# EAGLE schematic foxBMS_BMS-Slave_12cell (EAGLE 6.5.0), part 1 of 3
AUTHOR: Fraunhofer IISB foxBMS Team; REL-DATE: 2017-09-04; TITLE: foxBMS BMS-Slave 12-Cell; VERSION: 2.1.0
Assembly variants: foxBMS_Standard, foxBMS_Debug, foxBMS_DC-DC-only

## Sheet 1 of 17: Overview
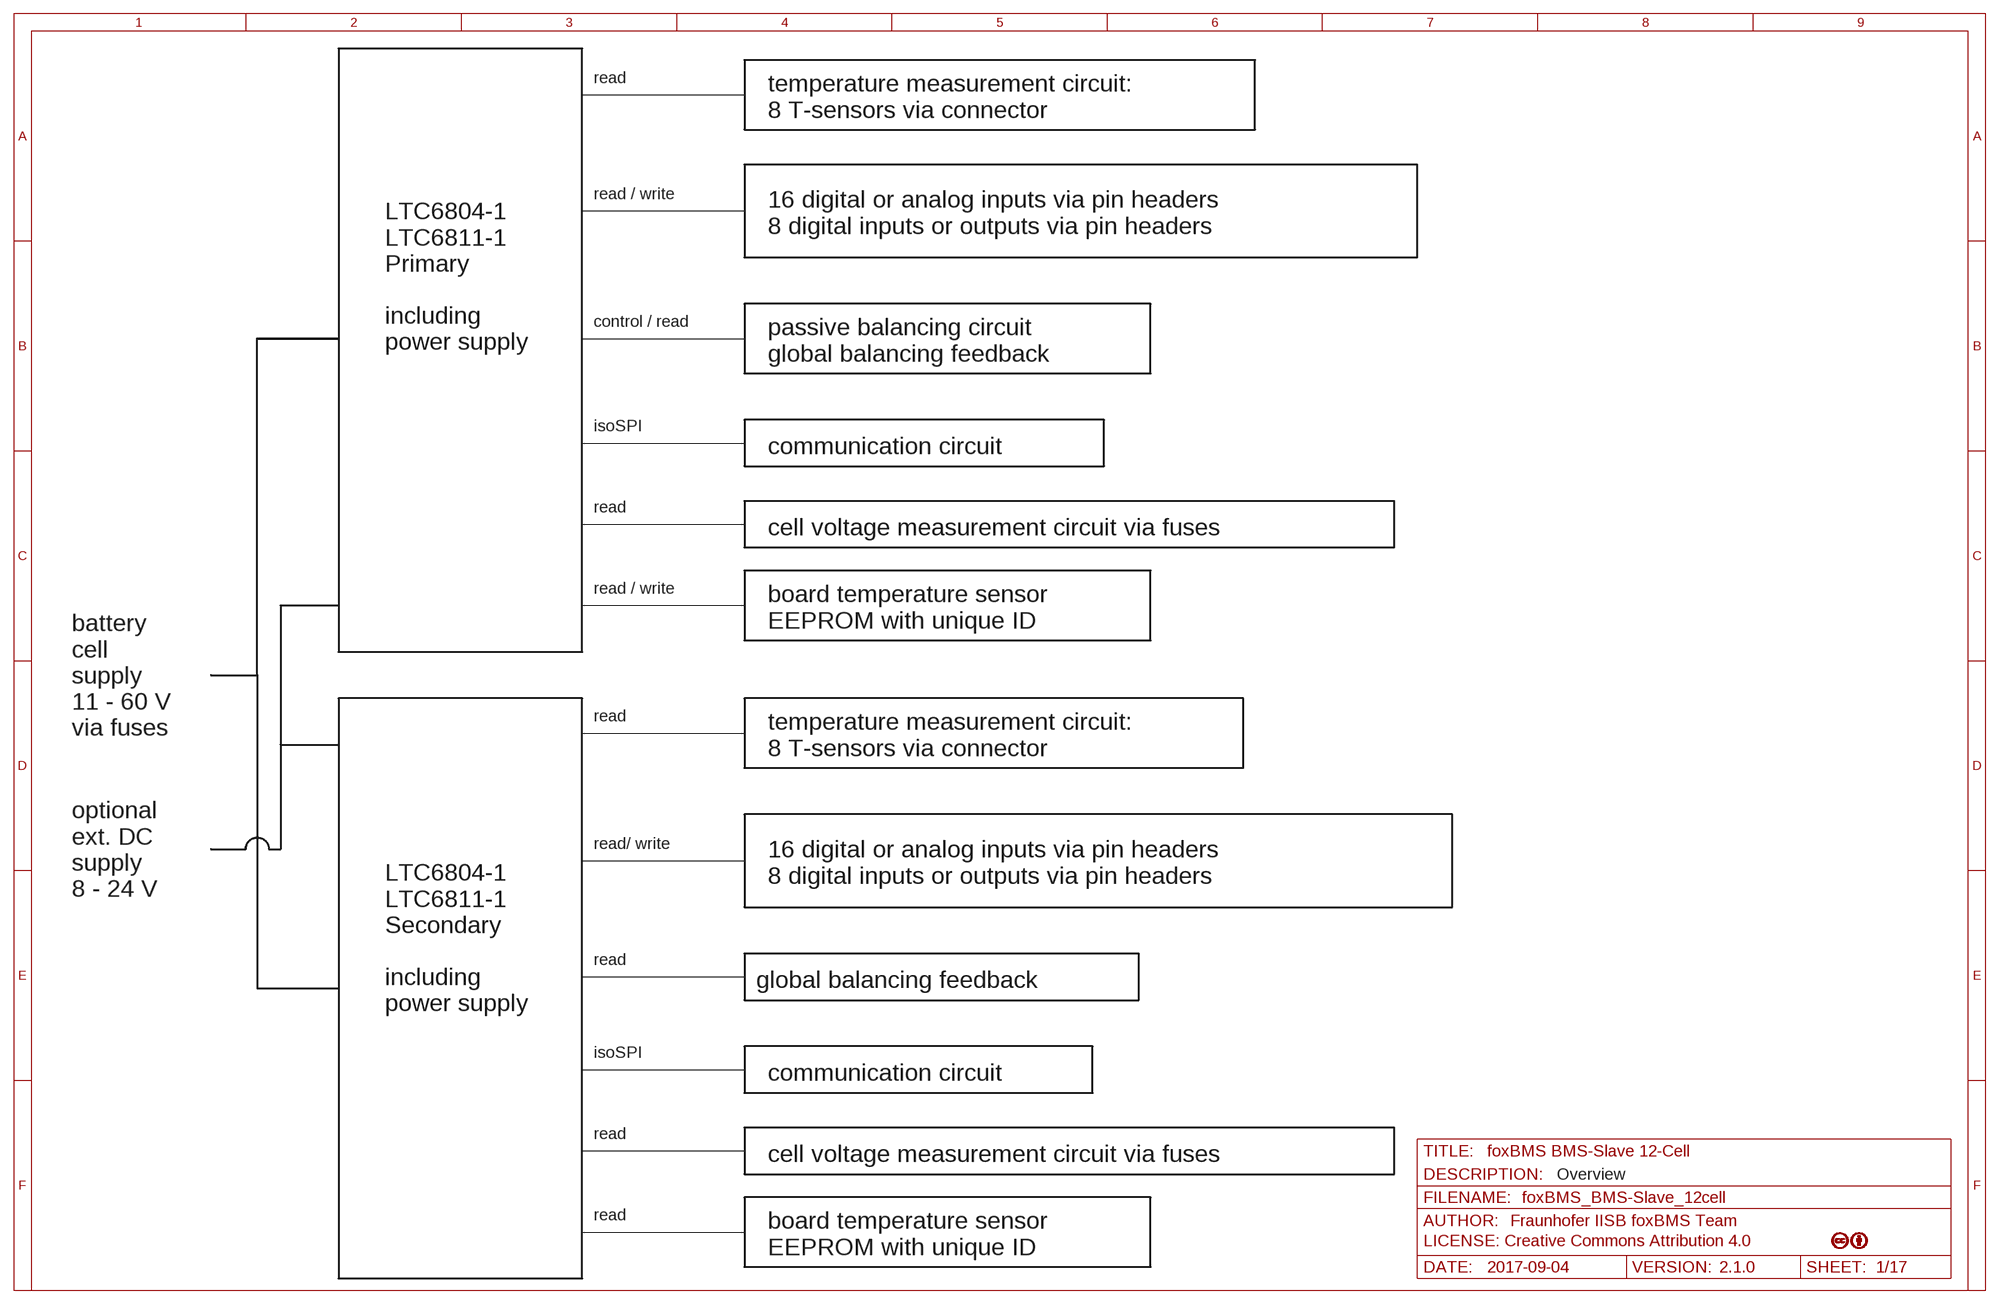
[diagram p0: schematic, sheet 1]

### Notes on the sheet
- read
- temperature measurement circuit:
  8 T-sensors via connector
- read / write
- 16 digital or analog inputs via pin headers
  8 digital inputs or outputs via pin headers
- control / read
- LTC6804-1
  LTC6811-1
  Primary
  
  including 
  power supply
- passive balancing circuit
  global balancing feedback
- isoSPI
- communication circuit
- read
- cell voltage measurement circuit via fuses
- read / write
- board temperature sensor
  EEPROM with unique ID
- battery 
  cell
  supply
  11 - 60 V
  via fuses
- read
- temperature measurement circuit:
  8 T-sensors via connector
- optional
  ext. DC
  supply
  8 - 24 V
- read/ write
- 16 digital or analog inputs via pin headers
  8 digital inputs or outputs via pin headers
- read
- global balancing feedback
- LTC6804-1
  LTC6811-1
  Secondary
  
  including 
  power supply
- isoSPI
- communication circuit
- read
- cell voltage measurement circuit via fuses
- Overview
- read
- board temperature sensor
  EEPROM with unique ID

## Sheet 2 of 17: Primary LTC6804
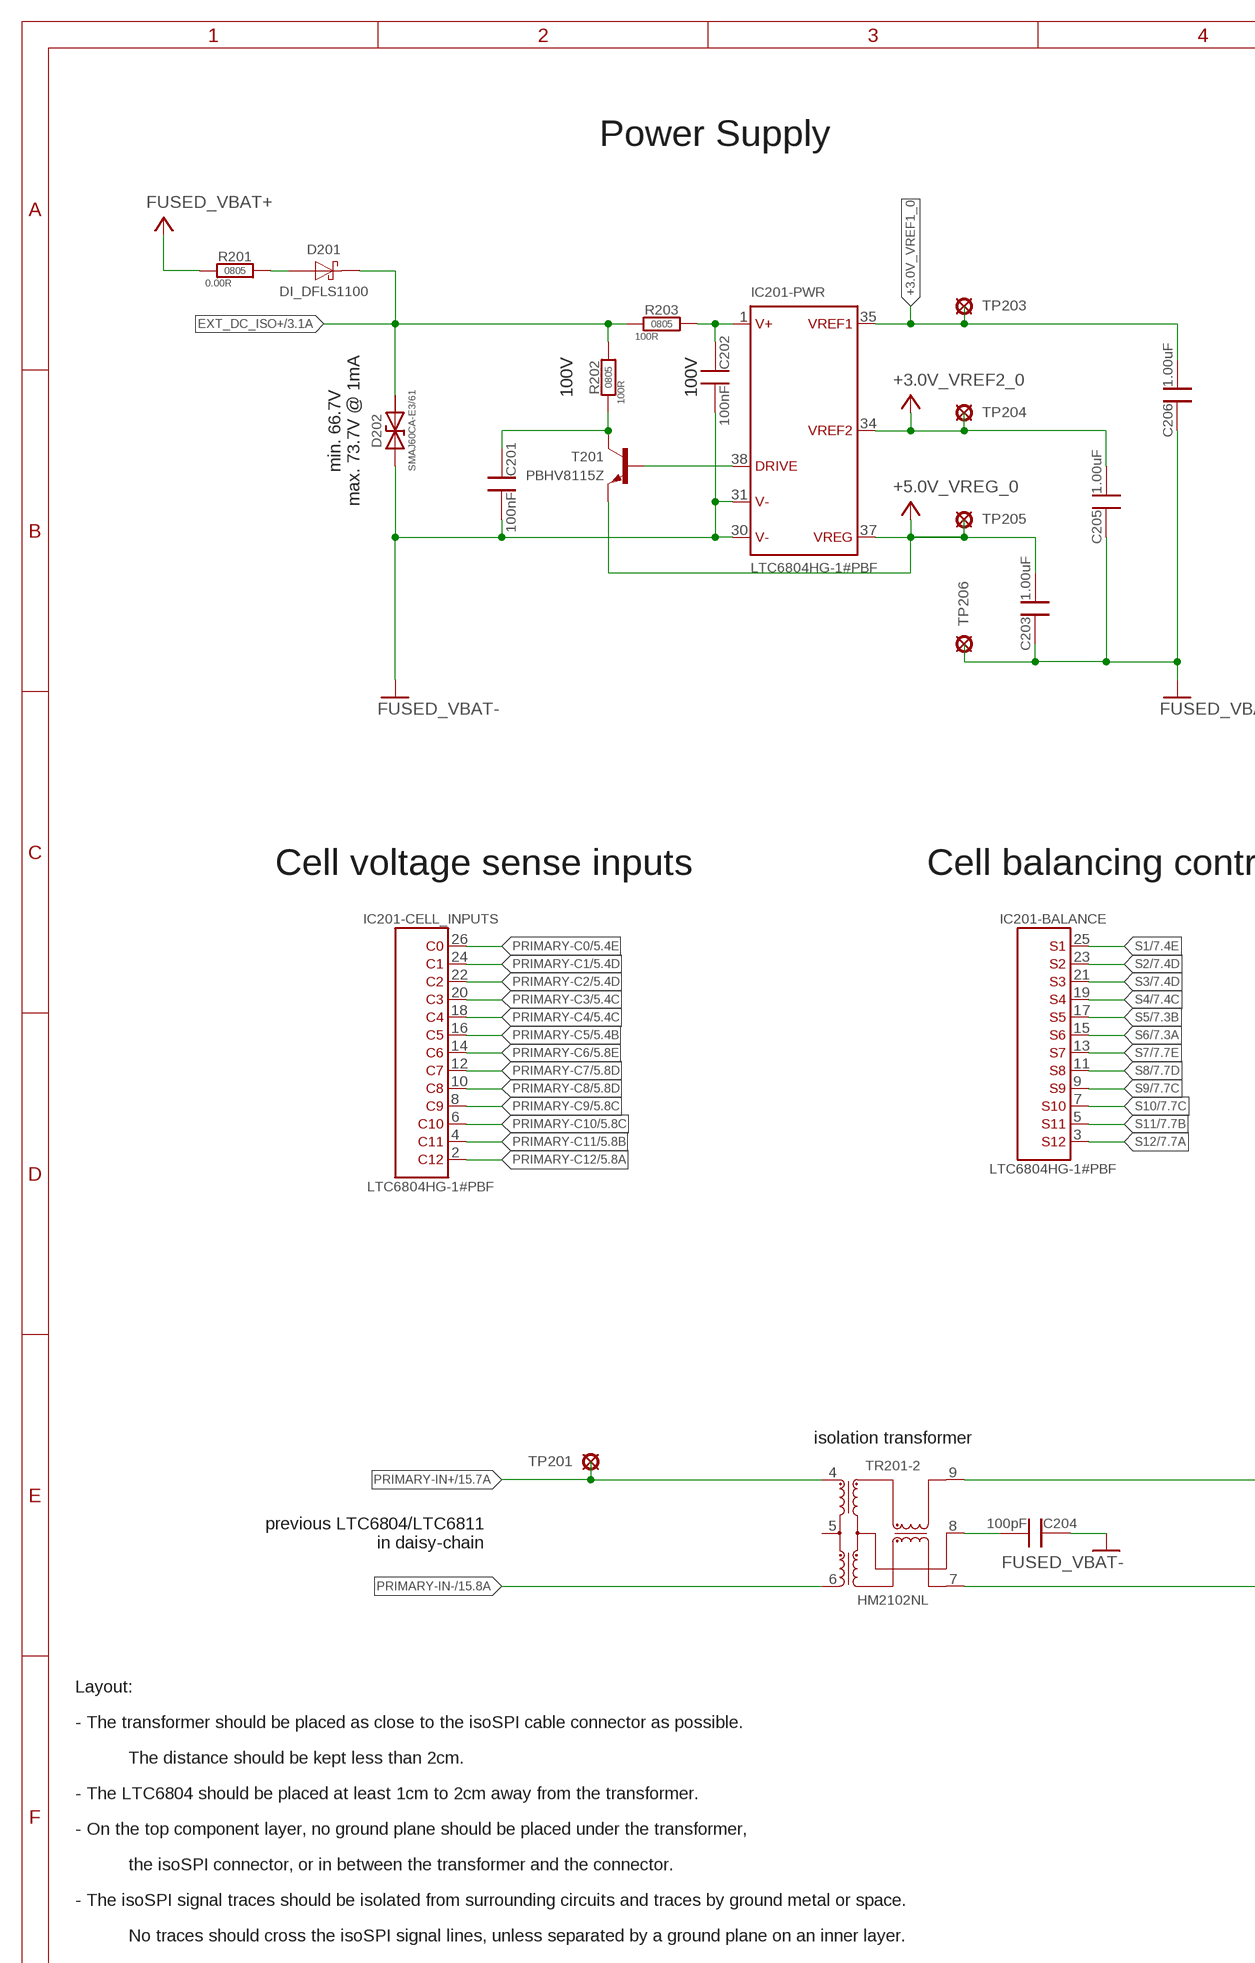
[diagram p1: schematic, sheet 2, part 1 of 2]
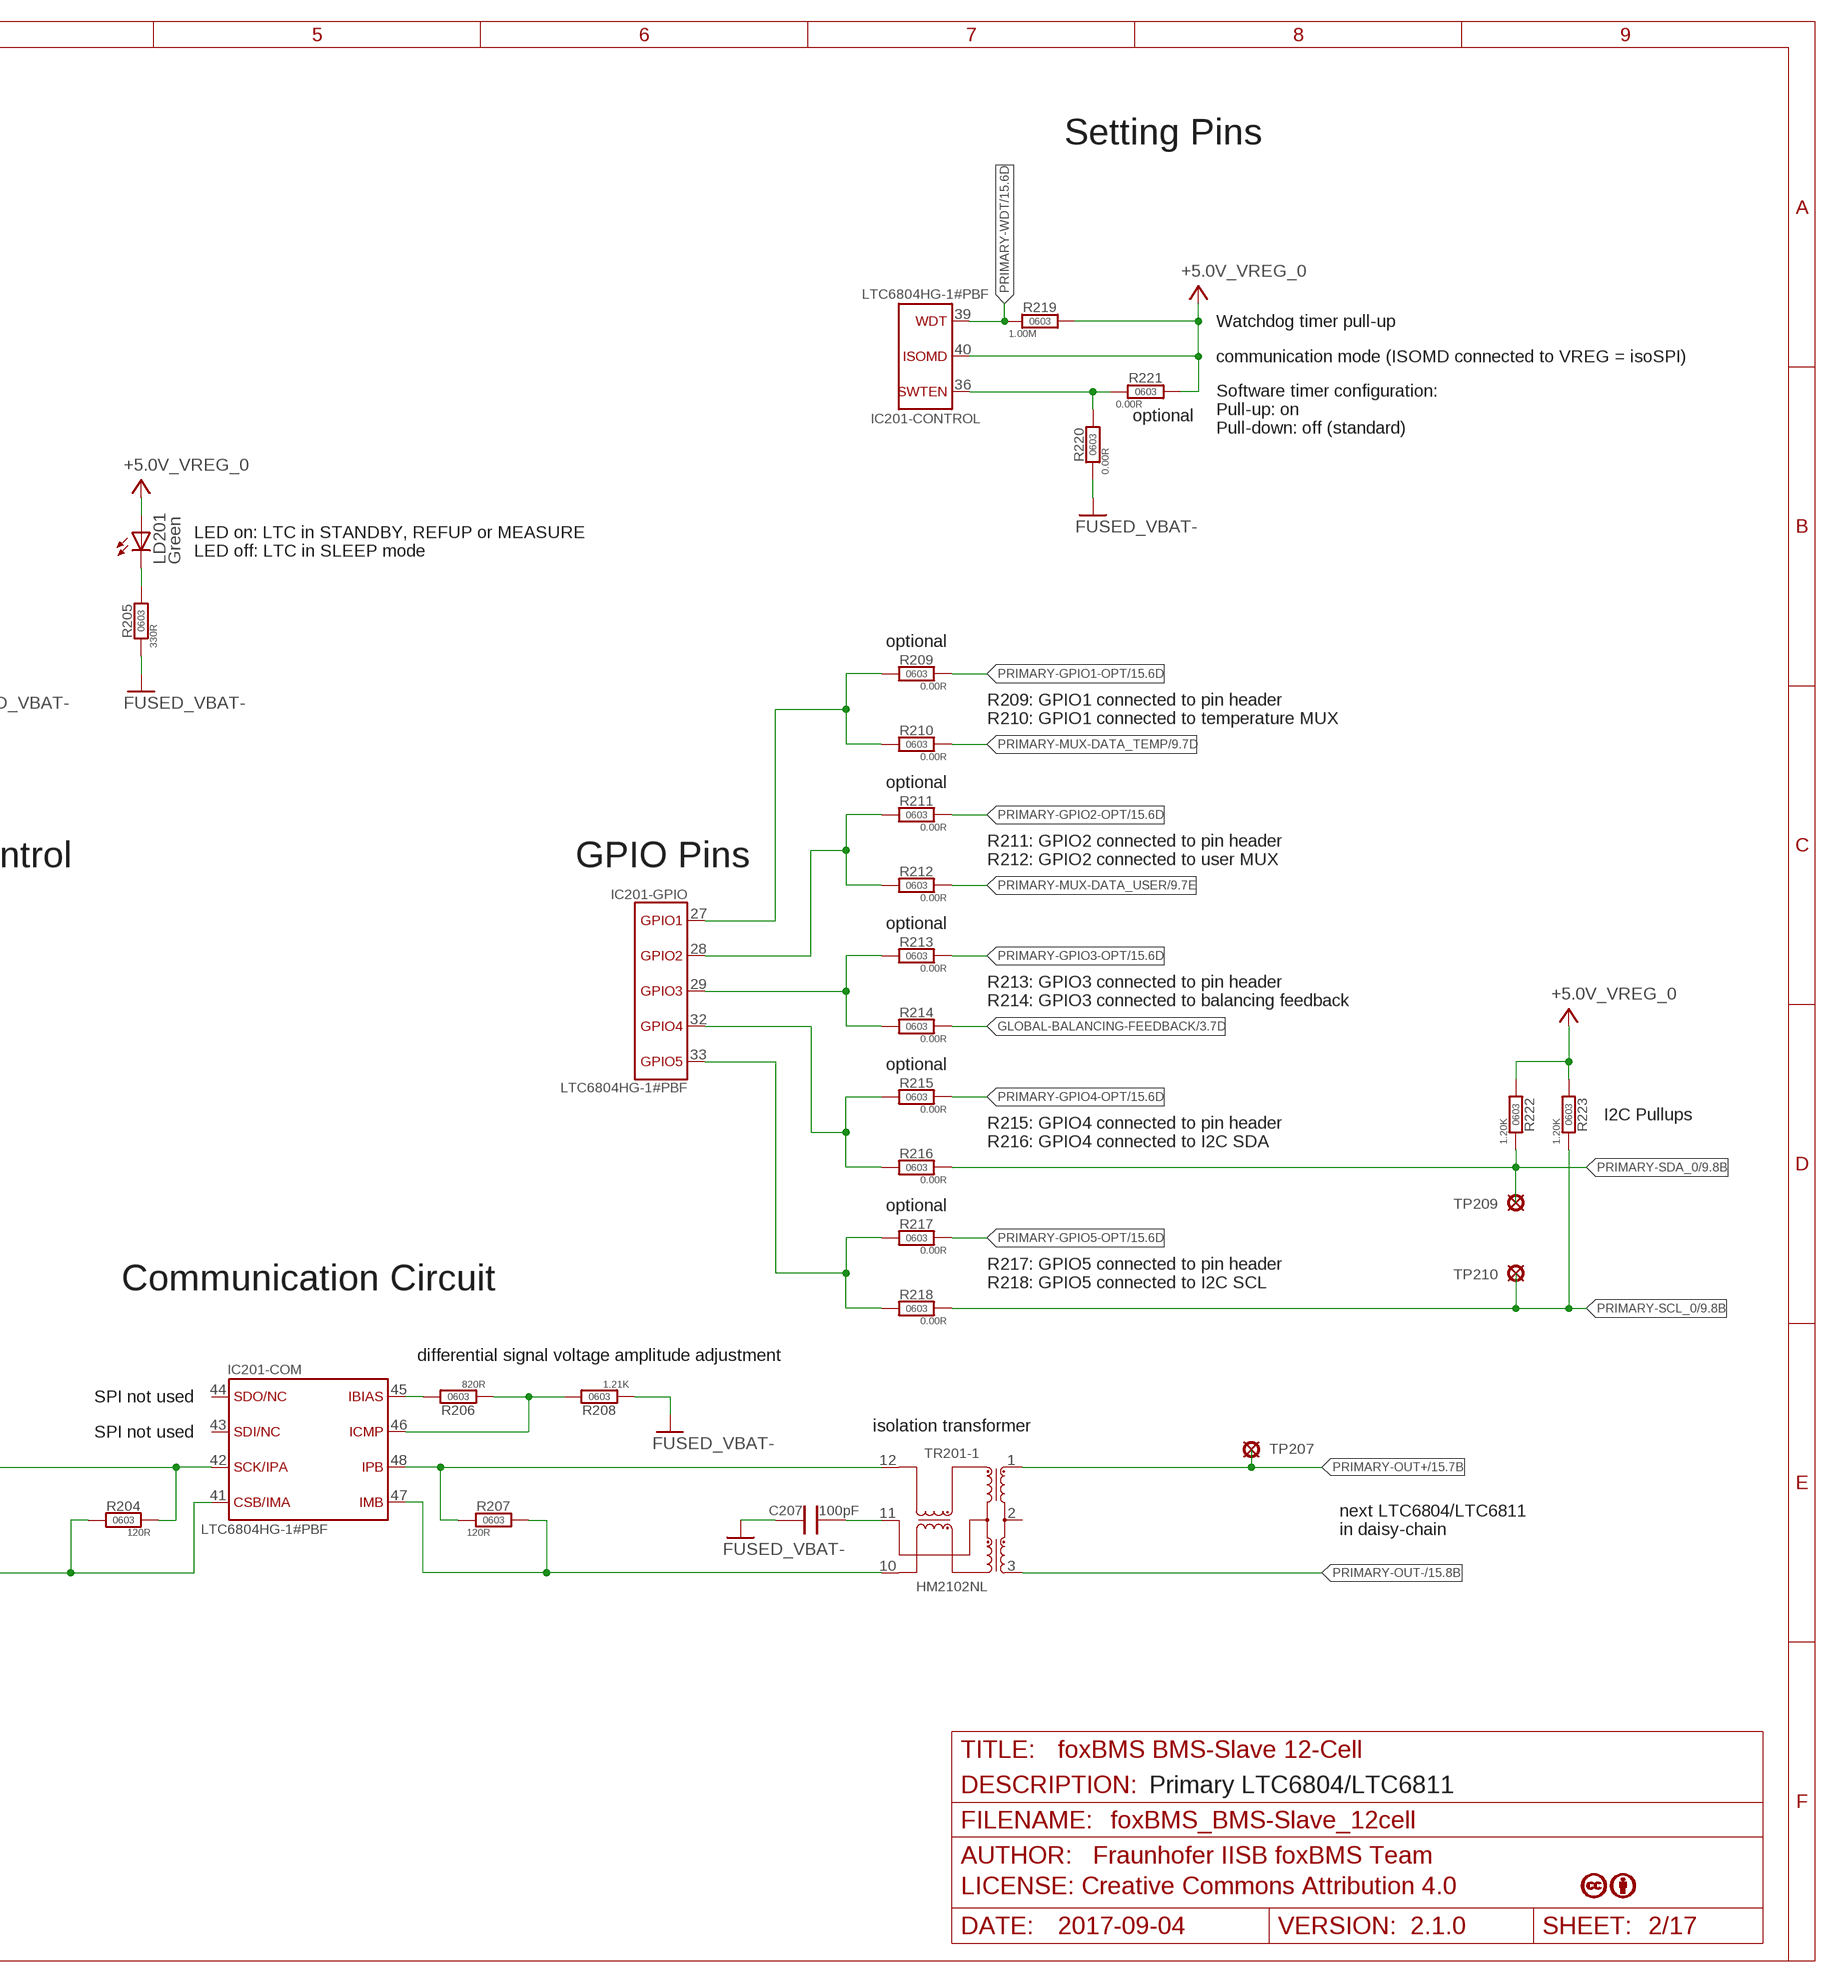
[diagram p2: schematic, sheet 2, part 2 of 2]

### Parts
C201  100nF, 10%, 100V  100NF_0805_100V_X7R_MULTICOMP  [C_SMD_0805_(2012)_R_MULTICOMP_REV01]  (not fitted in variant foxBMS_DC-DC-only)
C202  100nF, 10%, 100V  100NF_0805_100V_X7R_MULTICOMP  [C_SMD_0805_(2012)_R_MULTICOMP_REV01]  (not fitted in variant foxBMS_DC-DC-only)
C203  1uF, 20%, 16V  1,00µF_0603_16V_X7R_KEMET  [C_SMD_0603_(1608)_R_KEMET_REV01]  (not fitted in variant foxBMS_DC-DC-only)
C204  100pF, 15%, 25V  100PF_0603_50V_C0G_KEMET  [C_SMD_0603_(1608)_R_KEMET_REV01]  (not fitted in variant foxBMS_Debug)  (not fitted in variant foxBMS_DC-DC-only)
C205  1uF, 20%, 16V  1,00µF_0603_16V_X7R_KEMET  [C_SMD_0603_(1608)_R_KEMET_REV01]  (not fitted in variant foxBMS_DC-DC-only)
C206  1uF, 20%, 16V  1,00µF_0603_16V_X7R_KEMET  [C_SMD_0603_(1608)_R_KEMET_REV01]  (not fitted in variant foxBMS_DC-DC-only)
C207  100pF, 15%, 25V  100PF_0603_50V_C0G_KEMET  [C_SMD_0603_(1608)_R_KEMET_REV01]  (not fitted in variant foxBMS_Debug)  (not fitted in variant foxBMS_DC-DC-only)
D201  DI_DFLS1100  [POWER_DI_123]  (not fitted in variant foxBMS_DC-DC-only)
D202  SMAJ60CA_VISHAY  [D_SMD_SMA_(DO-214AC)_(BIDIR)_R_VISHAY_REV01]  (not fitted in variant foxBMS_Debug)  (not fitted in variant foxBMS_DC-DC-only)
IC201  0_LES_BATTERIE-MANAGEMENT.SMD_LTC6804HG-1  [0_LES_BATTERIE-MANAGEMENT.SMD_IC_SMD_SSOP-48_(G48)_R_LINEAR_REV01]  (not fitted in variant foxBMS_DC-DC-only)
LD201  Green  LEDCHIP-LED0603  [CHIP-LED0603]  (not fitted in variant foxBMS_Debug)  (not fitted in variant foxBMS_DC-DC-only)
R201  0,00R_0805_R_VISHAY_REV_01  [R_SMD_0805_R_VISHAY_REV01]  (not fitted in variant foxBMS_DC-DC-only)
R202  100R, 1%, 1/10W  100R_0805_R_VISHAY_1%_TK100_REV_01  [R_SMD_0805_R_VISHAY_REV01]  (not fitted in variant foxBMS_DC-DC-only)
R203  100R, 1%, 1/10W  100R_0805_R_VISHAY_1%_TK100_REV_01  [R_SMD_0805_R_VISHAY_REV01]  (not fitted in variant foxBMS_DC-DC-only)
R204  120R, 1%, 1/10W  120R_0603_R_VISHAY_1%_TK100_REV_01  [R_SMD_0603_R_VISHAY_REV01]  (not fitted in variant foxBMS_DC-DC-only)
R205  330R, 1%, 1/10W  330R_0603_R_VISHAY_1%_TK100_REV_01  [R_SMD_0603_R_VISHAY_REV01]  (not fitted in variant foxBMS_Debug)  (not fitted in variant foxBMS_DC-DC-only)
R206  820R, 1%, 1/10W  820R_0603_R_VISHAY_1%_TK100_REV_01  [R_SMD_0603_R_VISHAY_REV01]  (not fitted in variant foxBMS_DC-DC-only)
R207  120R, 1%, 1/10W  120R_0603_R_VISHAY_1%_TK100_REV_01  [R_SMD_0603_R_VISHAY_REV01]  (not fitted in variant foxBMS_DC-DC-only)
R208  1.21k, 1%, 1/10W  1,21K_0603_R_VISHAY_1%_TK100_REV_01  [R_SMD_0603_R_VISHAY_REV01]  (not fitted in variant foxBMS_DC-DC-only)
R209  OPT  0,00R_0603_R_VISHAY_REV_01  [R_SMD_0603_R_VISHAY_REV01]  (not fitted in variant foxBMS_Standard)  (not fitted in variant foxBMS_Debug)  (not fitted in variant foxBMS_DC-DC-only)
R210  0R  0,00R_0603_R_VISHAY_REV_01  [R_SMD_0603_R_VISHAY_REV01]  (not fitted in variant foxBMS_Debug)  (not fitted in variant foxBMS_DC-DC-only)
R211  OPT  0,00R_0603_R_VISHAY_REV_01  [R_SMD_0603_R_VISHAY_REV01]  (not fitted in variant foxBMS_Standard)  (not fitted in variant foxBMS_Debug)  (not fitted in variant foxBMS_DC-DC-only)
R212  0R  0,00R_0603_R_VISHAY_REV_01  [R_SMD_0603_R_VISHAY_REV01]  (not fitted in variant foxBMS_Debug)  (not fitted in variant foxBMS_DC-DC-only)
R213  OPT  0,00R_0603_R_VISHAY_REV_01  [R_SMD_0603_R_VISHAY_REV01]  (not fitted in variant foxBMS_Standard)  (not fitted in variant foxBMS_Debug)  (not fitted in variant foxBMS_DC-DC-only)
R214  0R  0,00R_0603_R_VISHAY_REV_01  [R_SMD_0603_R_VISHAY_REV01]  (not fitted in variant foxBMS_Debug)  (not fitted in variant foxBMS_DC-DC-only)
R215  OPT  0,00R_0603_R_VISHAY_REV_01  [R_SMD_0603_R_VISHAY_REV01]  (not fitted in variant foxBMS_Standard)  (not fitted in variant foxBMS_Debug)  (not fitted in variant foxBMS_DC-DC-only)
R216  0R  0,00R_0603_R_VISHAY_REV_01  [R_SMD_0603_R_VISHAY_REV01]  (not fitted in variant foxBMS_Debug)  (not fitted in variant foxBMS_DC-DC-only)
R217  OPT  0,00R_0603_R_VISHAY_REV_01  [R_SMD_0603_R_VISHAY_REV01]  (not fitted in variant foxBMS_Standard)  (not fitted in variant foxBMS_Debug)  (not fitted in variant foxBMS_DC-DC-only)
R218  0R  0,00R_0603_R_VISHAY_REV_01  [R_SMD_0603_R_VISHAY_REV01]  (not fitted in variant foxBMS_Debug)  (not fitted in variant foxBMS_DC-DC-only)
R219  1M, 10%, 1/10W  1,00M_0603_R_VISHAY_1%_TK100_REV_01  [R_SMD_0603_R_VISHAY_REV01]  (not fitted in variant foxBMS_Debug)  (not fitted in variant foxBMS_DC-DC-only)
R220  0R  0,00R_0603_R_VISHAY_REV_01  [R_SMD_0603_R_VISHAY_REV01]  (not fitted in variant foxBMS_Debug)  (not fitted in variant foxBMS_DC-DC-only)
R221  OPT  0,00R_0603_R_VISHAY_REV_01  [R_SMD_0603_R_VISHAY_REV01]  (not fitted in variant foxBMS_Standard)  (not fitted in variant foxBMS_Debug)  (not fitted in variant foxBMS_DC-DC-only)
R222  1.2k, 10%, 1/10W  1,20K_0603_R_VISHAY_1%_TK100_REV_01  [R_SMD_0603_R_VISHAY_REV01]  (not fitted in variant foxBMS_Debug)  (not fitted in variant foxBMS_DC-DC-only)
R223  1.2k, 10%, 1/10W  1,20K_0603_R_VISHAY_1%_TK100_REV_01  [R_SMD_0603_R_VISHAY_REV01]  (not fitted in variant foxBMS_Debug)  (not fitted in variant foxBMS_DC-DC-only)
T201  PBHV8115Z  [D_SMD_SOT223_(SC-73)_R_NXP_REV01]  (not fitted in variant foxBMS_DC-DC-only)
TP201  CUSTOM_PAD_PAD_2.0X1.5MM  [CUSTOM_PAD_PAD2.0X1.5MM]  (not fitted in variant foxBMS_Standard)  (not fitted in variant foxBMS_Debug)  (not fitted in variant foxBMS_DC-DC-only)
TP203  CUSTOM_PAD_PAD_2.0X1.5MM  [CUSTOM_PAD_PAD2.0X1.5MM]  (not fitted in variant foxBMS_Standard)  (not fitted in variant foxBMS_Debug)  (not fitted in variant foxBMS_DC-DC-only)
TP204  CUSTOM_PAD_PAD_2.0X1.5MM  [CUSTOM_PAD_PAD2.0X1.5MM]  (not fitted in variant foxBMS_Standard)  (not fitted in variant foxBMS_Debug)  (not fitted in variant foxBMS_DC-DC-only)
TP205  CUSTOM_PAD_PAD_2.0X1.5MM  [CUSTOM_PAD_PAD2.0X1.5MM]  (not fitted in variant foxBMS_Standard)  (not fitted in variant foxBMS_Debug)  (not fitted in variant foxBMS_DC-DC-only)
TP206  CUSTOM_PAD_PAD_2.0X1.5MM  [CUSTOM_PAD_PAD2.0X1.5MM]  (not fitted in variant foxBMS_Debug)  (not fitted in variant foxBMS_DC-DC-only)
TP207  CUSTOM_PAD_PAD_2.0X1.5MM  [CUSTOM_PAD_PAD2.0X1.5MM]  (not fitted in variant foxBMS_Standard)  (not fitted in variant foxBMS_Debug)  (not fitted in variant foxBMS_DC-DC-only)
TP209  CUSTOM_PAD_PAD_2.0X1.5MM  [CUSTOM_PAD_PAD2.0X1.5MM]  (not fitted in variant foxBMS_Debug)  (not fitted in variant foxBMS_DC-DC-only)
TP210  CUSTOM_PAD_PAD_2.0X1.5MM  [CUSTOM_PAD_PAD2.0X1.5MM]  (not fitted in variant foxBMS_Debug)  (not fitted in variant foxBMS_DC-DC-only)
TR201  HM2102NL  [HM2102NL]  (not fitted in variant foxBMS_DC-DC-only)

### Nets
+3.0V_VREF1_0: C206.2 IC201.35(-PWR:VREF1) TP203.P$1(MP)
+3.0V_VREF2_0: C205.2 IC201.34(-PWR:VREF2) TP204.P$1(MP) ; also sheet 9,15
+5.0V_VREG_0: C203.2 IC201.37(-PWR:VREG) IC201.40(-CONTROL:ISOMD) LD201.A R219.2 R221.2 R222.2 R223.2 T201.3(E) TP205.P$1(MP) ; also sheet 8,9,11,13,15
EXT_DC_ISO+: D201.K(C) D202.C(K2) R202.2 R203.1 ; also sheet 3,16
FUSED_VBAT+: R201.1 ; also sheet 3,4
FUSED_VBAT-: C201.P$2 C202.P$2 C203.1 C204.1 C205.1 C206.1 C207.1 D202.A(K1) IC201.30(-PWR:V-1) IC201.31(-PWR:V-2) R205.1 R208.1 R220.1 TP206.P$1(MP) ; also sheet 3,4,5,6,8,9,10,11,12,13,14,15,16
GLOBAL-BALANCING-FEEDBACK: R214.1 ; also sheet 3,8
N$5: C207.2 TR201.11(-1:CMT)
N$7: C201.P$1 R202.1 T201.2(C) T201.4(C)
N$9: C204.2 TR201.8(-2:CMT)
N$10: IC201.38(-PWR:DRIVE) T201.1(B)
N$12: IC201.45(-COM:IBIAS) R206.2
N$17: C202.P$1 IC201.1(-PWR:V+) R203.2
N$34: LD201.C R205.2
N$76: D201.A R201.2
PRIMARY-C0: IC201.26(-CELL_INPUTS:C0) ; also sheet 5
PRIMARY-C1: IC201.24(-CELL_INPUTS:C1) ; also sheet 5
PRIMARY-C2: IC201.22(-CELL_INPUTS:C2) ; also sheet 5
PRIMARY-C3: IC201.20(-CELL_INPUTS:C3) ; also sheet 5
PRIMARY-C4: IC201.18(-CELL_INPUTS:C4) ; also sheet 5
PRIMARY-C5: IC201.16(-CELL_INPUTS:C5) ; also sheet 5
PRIMARY-C6: IC201.14(-CELL_INPUTS:C6) ; also sheet 5
PRIMARY-C7: IC201.12(-CELL_INPUTS:C7) ; also sheet 5
PRIMARY-C8: IC201.10(-CELL_INPUTS:C8) ; also sheet 5
PRIMARY-C9: IC201.8(-CELL_INPUTS:C9) ; also sheet 5
PRIMARY-C10: IC201.6(-CELL_INPUTS:C10) ; also sheet 5
PRIMARY-C11: IC201.4(-CELL_INPUTS:C11) ; also sheet 5
PRIMARY-C12: IC201.2(-CELL_INPUTS:C12) ; also sheet 5
PRIMARY-GPIO0: IC201.27(-GPIO:GPIO1) R209.2 R210.2
PRIMARY-GPIO1: IC201.28(-GPIO:GPIO2) R211.2 R212.2
PRIMARY-GPIO1-OPT: R209.1 ; also sheet 15
PRIMARY-GPIO2-OPT: R211.1 ; also sheet 15
PRIMARY-GPIO3: IC201.32(-GPIO:GPIO4) R215.2 R216.2
PRIMARY-GPIO3-OPT: R213.1 ; also sheet 15
PRIMARY-GPIO4: IC201.33(-GPIO:GPIO5) R217.2 R218.2
PRIMARY-GPIO4-OPT: R215.1 ; also sheet 15
PRIMARY-GPIO5: IC201.29(-GPIO:GPIO3) R213.2 R214.2
PRIMARY-GPIO5-OPT: R217.1 ; also sheet 15
PRIMARY-ICMP: IC201.46(-COM:ICMP) R206.1 R208.2
PRIMARY-IN+: TP201.P$1(MP) TR201.4(-2:D+) ; also sheet 15
PRIMARY-IN-: TR201.6(-2:D-) ; also sheet 15
PRIMARY-IN_N1 [DiffPair]: IC201.41(-COM:CSB/IMA) R204.2 TR201.7(-2:X-)
PRIMARY-IN_P1 [DiffPair]: IC201.42(-COM:SCK/IPA) R204.1 TR201.9(-2:X+)
PRIMARY-MUX-DATA_TEMP: R210.1 ; also sheet 9
PRIMARY-MUX-DATA_USER: R212.1 ; also sheet 9
PRIMARY-OUT+: TP207.P$1(MP) TR201.1(-1:D+) ; also sheet 15
PRIMARY-OUT-: TR201.3(-1:D-) ; also sheet 15
PRIMARY-OUT_N1 [DiffPair]: IC201.47(-COM:IMB) R207.2 TR201.10(-1:X-)
PRIMARY-OUT_P1 [DiffPair]: IC201.48(-COM:IPB) R207.1 TR201.12(-1:X+)
PRIMARY-SCL_0: R218.1 R223.1 TP210.P$1(MP) ; also sheet 9,11,13
PRIMARY-SDA_0: R216.1 R222.1 TP209.P$1(MP) ; also sheet 9,11,13
PRIMARY-SWTEN: IC201.36(-CONTROL:SWTEN) R220.2 R221.1
PRIMARY-WDT: IC201.39(-CONTROL:WDT) R219.1 ; also sheet 15
S1: IC201.25(-BALANCE:S1) ; also sheet 7
S2: IC201.23(-BALANCE:S2) ; also sheet 7
S3: IC201.21(-BALANCE:S3) ; also sheet 7
S4: IC201.19(-BALANCE:S4) ; also sheet 7
S5: IC201.17(-BALANCE:S5) ; also sheet 7
S6: IC201.15(-BALANCE:S6) ; also sheet 7
S7: IC201.13(-BALANCE:S7) ; also sheet 7
S8: IC201.11(-BALANCE:S8) ; also sheet 7
S9: IC201.9(-BALANCE:S9) ; also sheet 7
S10: IC201.7(-BALANCE:S10) ; also sheet 7
S11: IC201.5(-BALANCE:S11) ; also sheet 7
S12: IC201.3(-BALANCE:S12) ; also sheet 7
Unconnected: IC201.43(-COM:SDI/NC) IC201.44(-COM:SDO/NC) TR201.2(-1:CT) TR201.5(-2:CT)

### Notes on the sheet
- Power Supply | Setting Pins
- Watchdog timer pull-up
- communication mode (ISOMD connected to VREG = isoSPI)
- 100V | 100V
- optional
- Software timer configuration:
  Pull-up: on 
  Pull-down: off (standard)
- min. 66.7V
  max. 73.7V @ 1mA
- LED on: LTC in STANDBY, REFUP or MEASURE
  LED off: LTC in SLEEP mode
- optional
- R209: GPIO1 connected to pin header
  R210: GPIO1 connected to temperature MUX
- optional
- R211: GPIO2 connected to pin header
  R212: GPIO2 connected to user MUX
- Cell voltage sense inputs | Cell balancing control | GPIO Pins
- optional
- R213: GPIO3 connected to pin header
  R214: GPIO3 connected to balancing feedback
- optional
- I2C Pullups
- R215: GPIO4 connected to pin header
  R216: GPIO4 connected to I2C SDA
- optional
- R217: GPIO5 connected to pin header
  R218: GPIO5 connected to I2C SCL
- Communication Circuit
- differential signal voltage amplitude adjustment
- SPI not used
- isolation transformer | SPI not used | isolation transformer
- previous LTC6804/LTC6811
  in daisy-chain
- next LTC6804/LTC6811
  in daisy-chain
- Layout:
- - The transformer should be placed as close to the isoSPI cable connector as possible.
- The distance should be kept less than 2cm.
- - The LTC6804 should be placed at least 1cm to 2cm away from the transformer.
- Primary LTC6804/LTC6811
- - On the top component layer, no ground plane should be placed under the transformer,
- the isoSPI connector, or in between the transformer and the connector.
- - The isoSPI signal traces should be isolated from surrounding circuits and traces by ground metal or space.
- No traces should cross the isoSPI signal lines, unless separated by a ground plane on an inner layer.

## Sheet 3 of 17: Secondary LTC6804
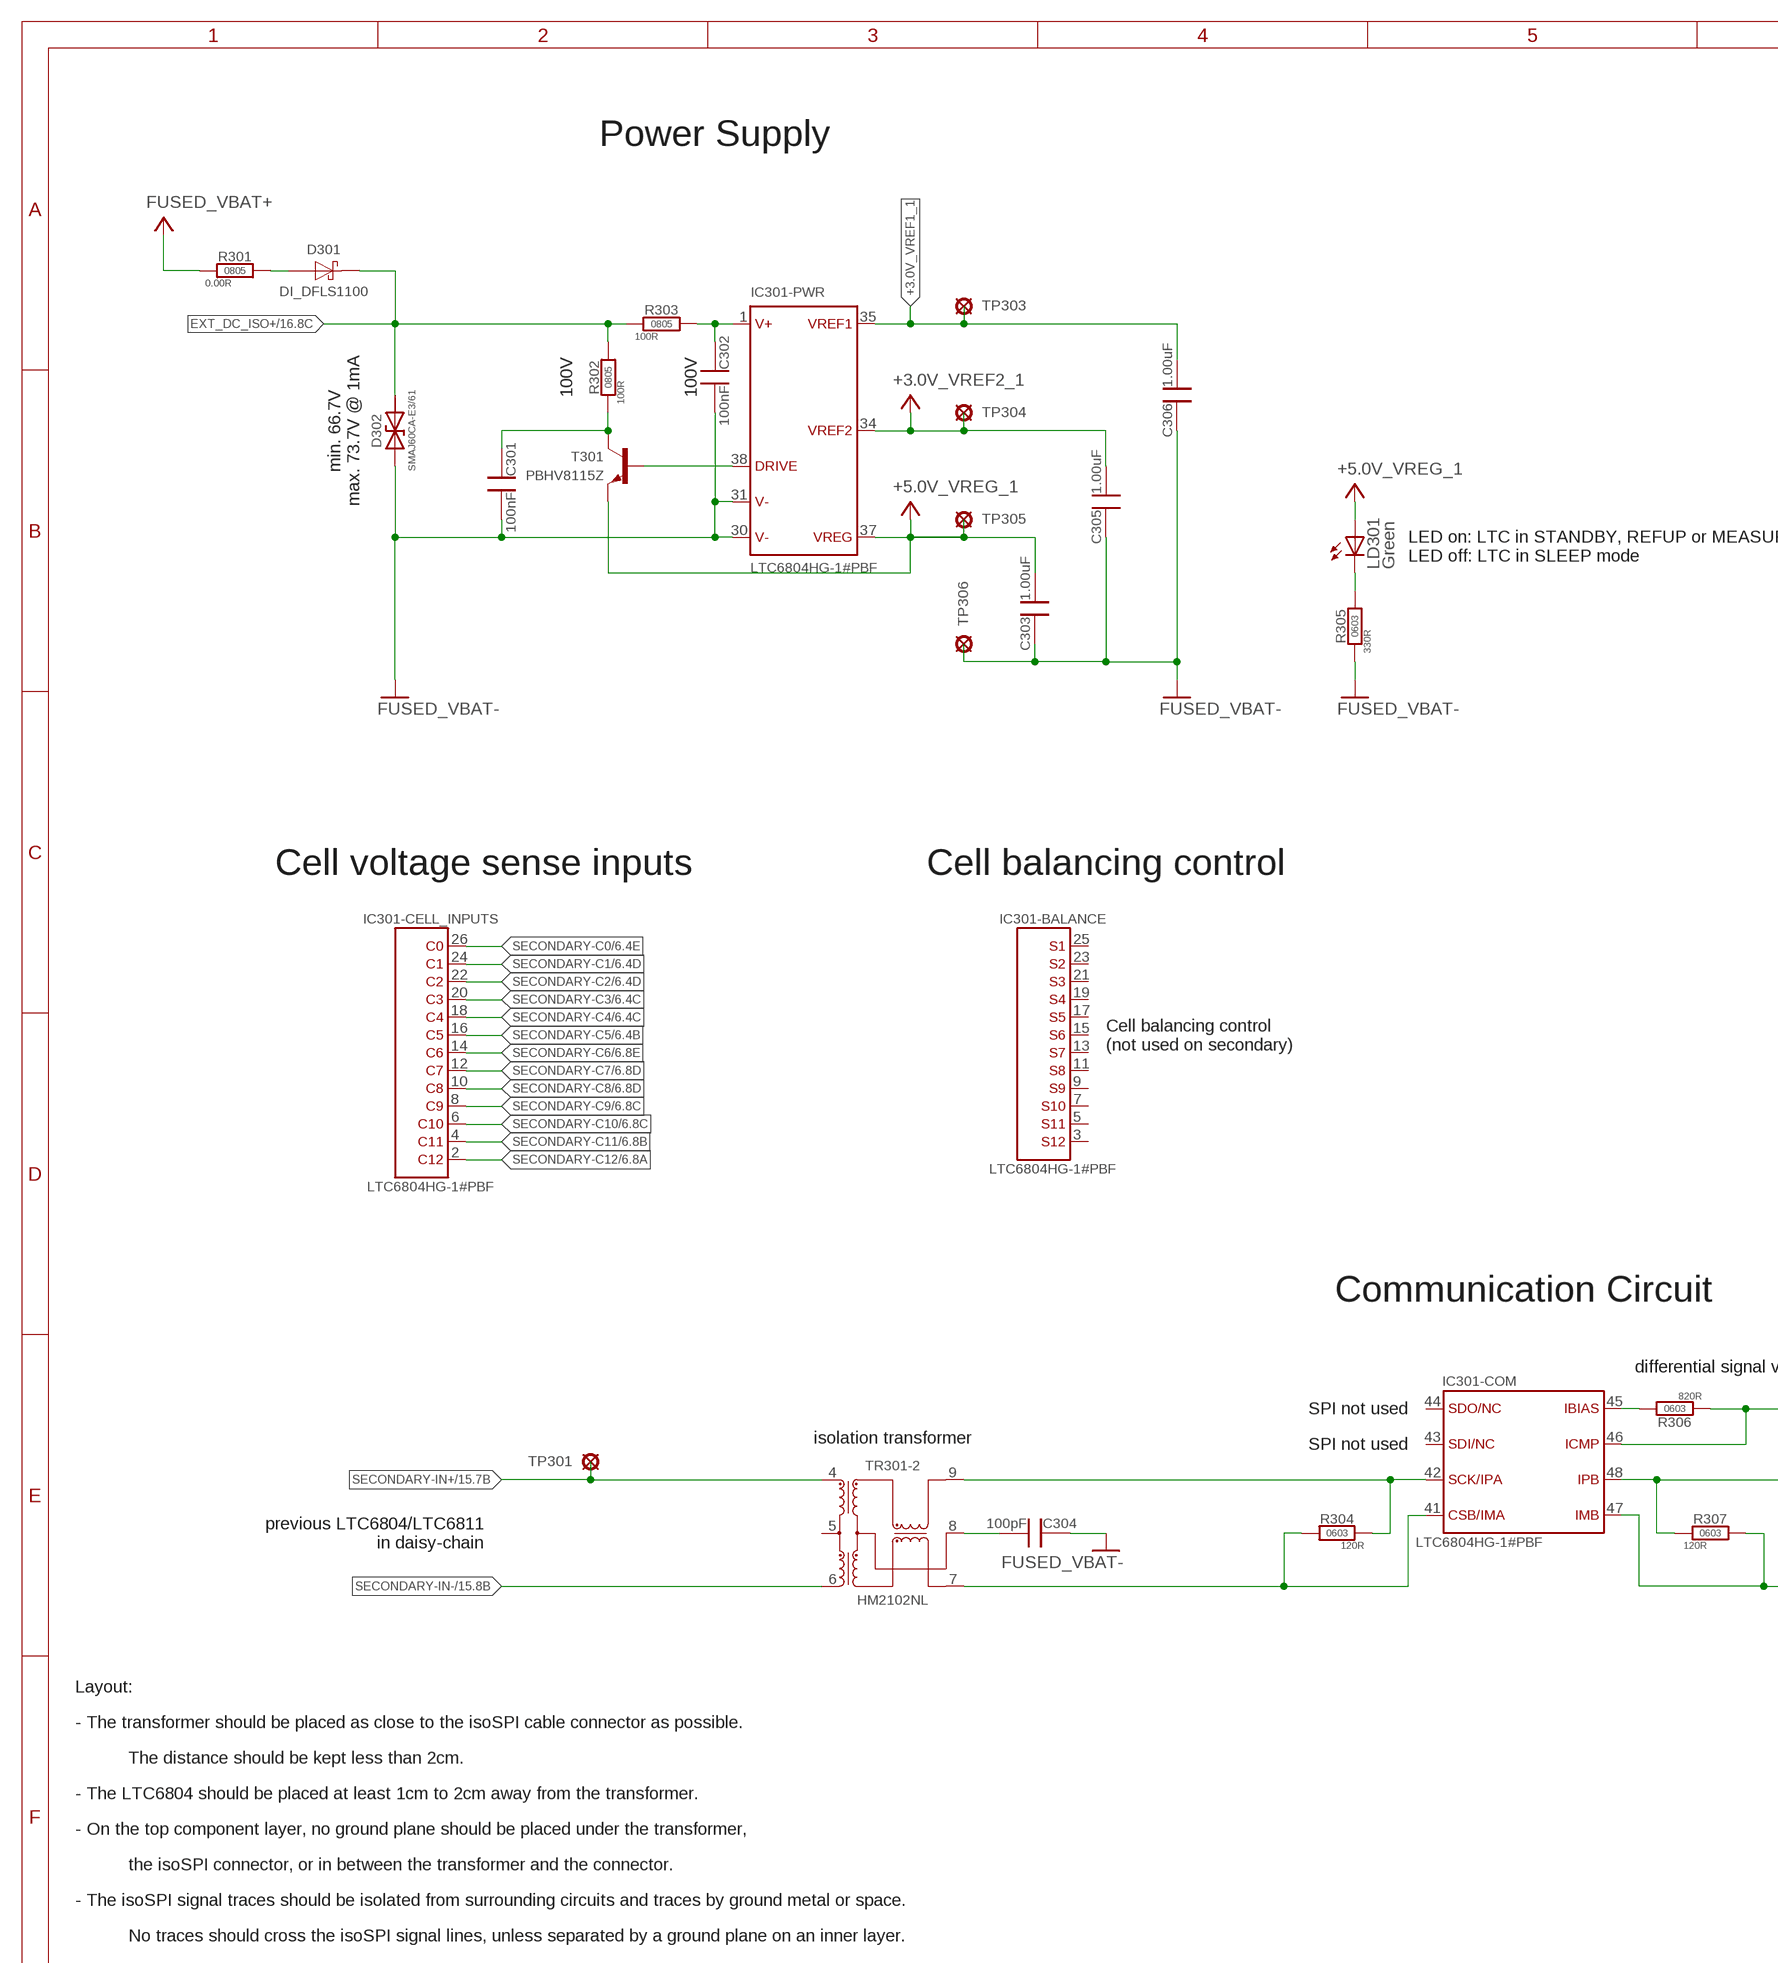
[diagram p3: schematic, sheet 3, part 1 of 2]
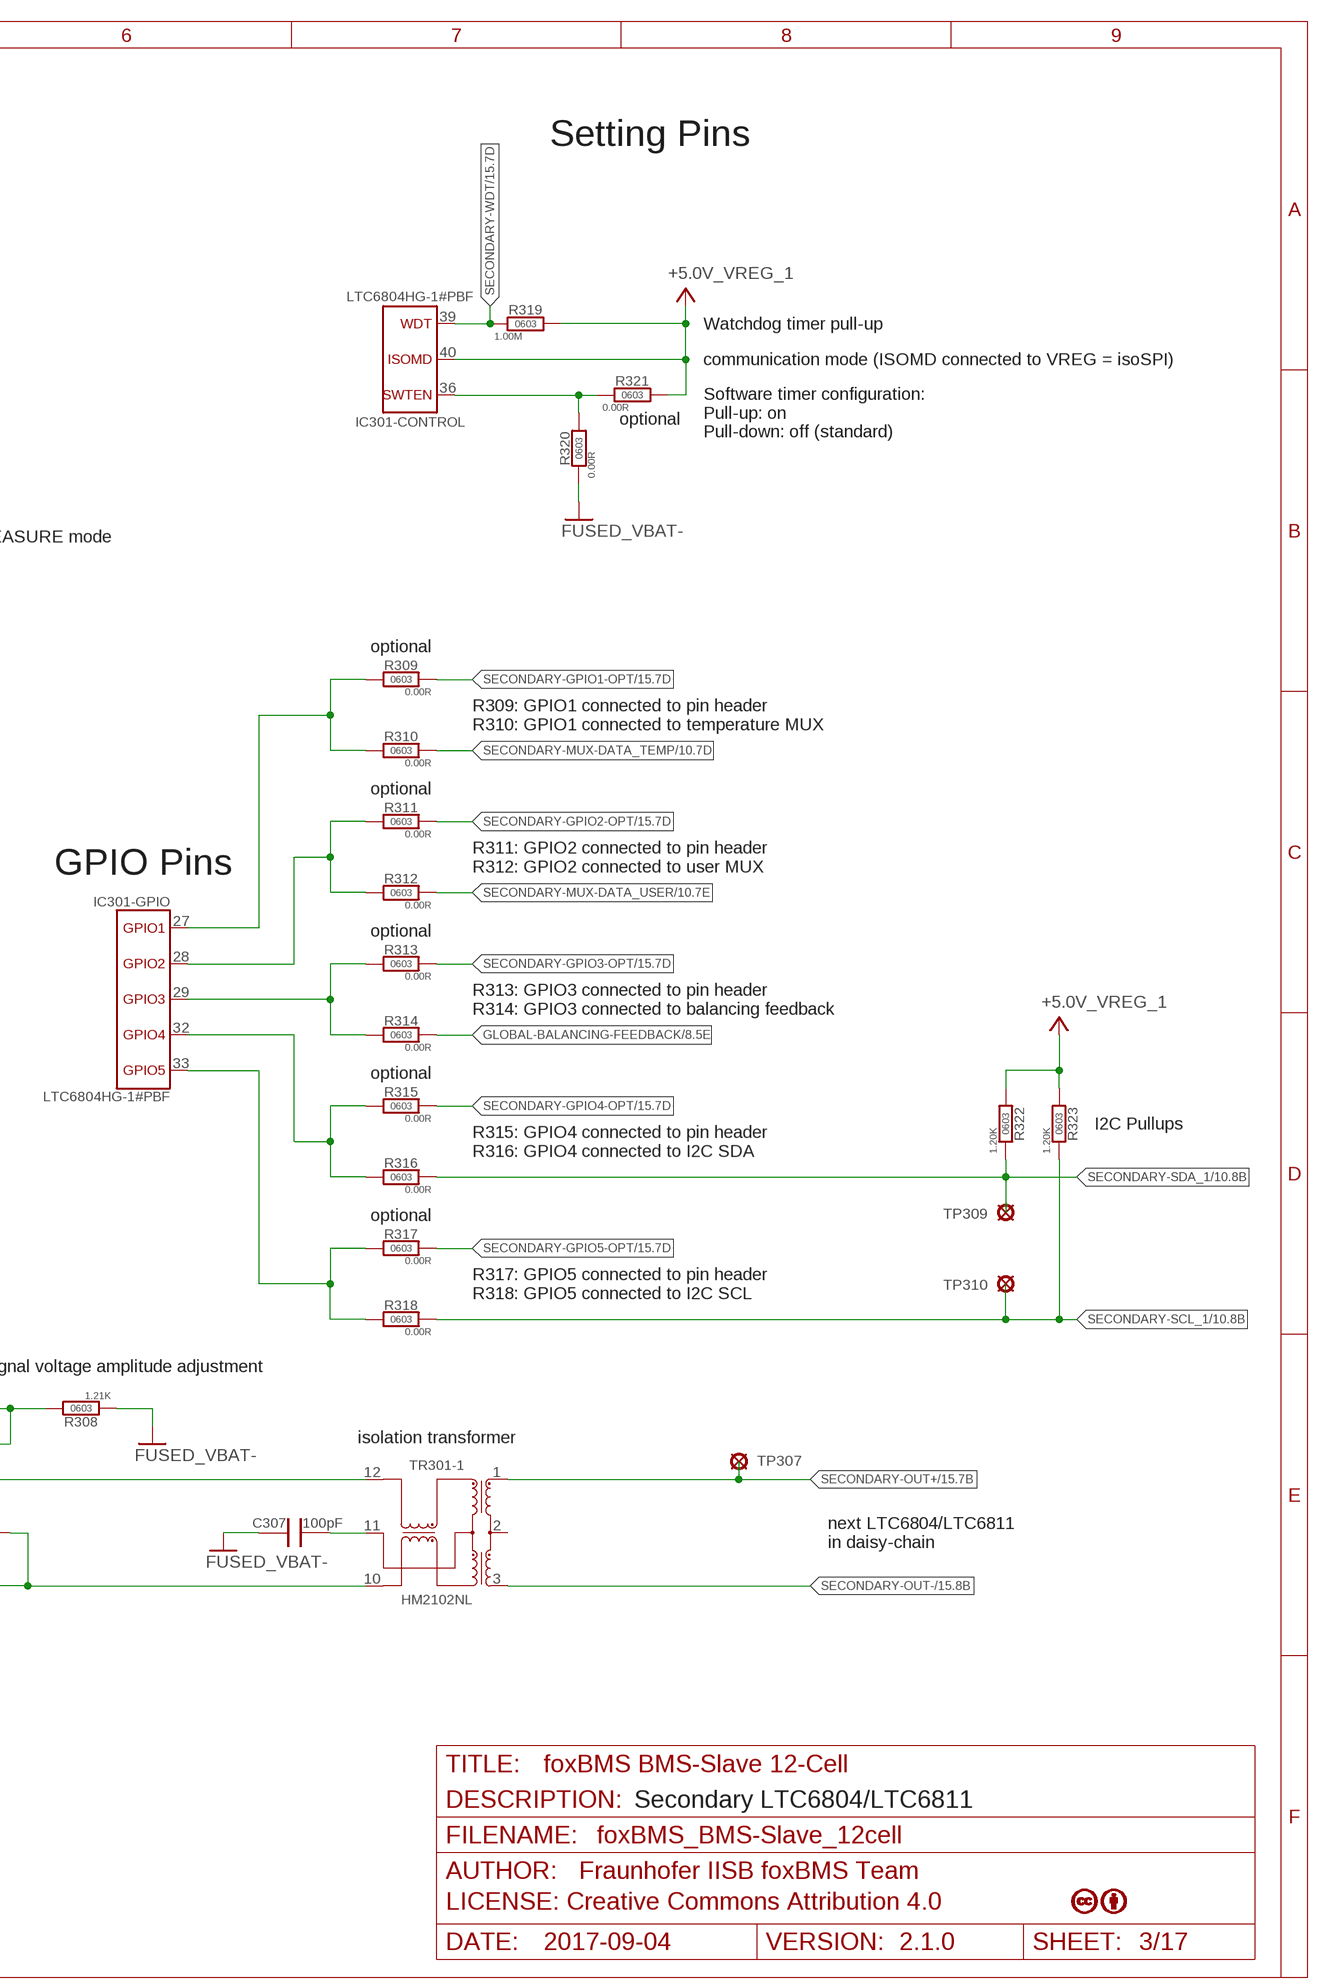
[diagram p4: schematic, sheet 3, part 2 of 2]

### Parts
C301  100nF, 10%, 100V  100NF_0805_100V_X7R_MULTICOMP  [C_SMD_0805_(2012)_R_MULTICOMP_REV01]  (not fitted in variant foxBMS_DC-DC-only)
C302  100nF, 10%, 100V  100NF_0805_100V_X7R_MULTICOMP  [C_SMD_0805_(2012)_R_MULTICOMP_REV01]  (not fitted in variant foxBMS_DC-DC-only)
C303  1uF, 20%, 16V  1,00µF_0603_16V_X7R_KEMET  [C_SMD_0603_(1608)_R_KEMET_REV01]  (not fitted in variant foxBMS_DC-DC-only)
C304  100pF, 15%, 25V  100PF_0603_50V_C0G_KEMET  [C_SMD_0603_(1608)_R_KEMET_REV01]  (not fitted in variant foxBMS_Debug)  (not fitted in variant foxBMS_DC-DC-only)
C305  1uF, 20%, 16V  1,00µF_0603_16V_X7R_KEMET  [C_SMD_0603_(1608)_R_KEMET_REV01]  (not fitted in variant foxBMS_DC-DC-only)
C306  1uF, 20%, 16V  1,00µF_0603_16V_X7R_KEMET  [C_SMD_0603_(1608)_R_KEMET_REV01]  (not fitted in variant foxBMS_DC-DC-only)
C307  100pF, 15%, 25V  100PF_0603_50V_C0G_KEMET  [C_SMD_0603_(1608)_R_KEMET_REV01]  (not fitted in variant foxBMS_Debug)  (not fitted in variant foxBMS_DC-DC-only)
D301  DI_DFLS1100  [POWER_DI_123]  (not fitted in variant foxBMS_DC-DC-only)
D302  SMAJ60CA_VISHAY  [D_SMD_SMA_(DO-214AC)_(BIDIR)_R_VISHAY_REV01]  (not fitted in variant foxBMS_Debug)  (not fitted in variant foxBMS_DC-DC-only)
IC301  0_LES_BATTERIE-MANAGEMENT.SMD_LTC6804HG-1  [0_LES_BATTERIE-MANAGEMENT.SMD_IC_SMD_SSOP-48_(G48)_R_LINEAR_REV01]  (not fitted in variant foxBMS_DC-DC-only)
LD301  Green  LEDCHIP-LED0603  [CHIP-LED0603]  (not fitted in variant foxBMS_Debug)  (not fitted in variant foxBMS_DC-DC-only)
R301  0,00R_0805_R_VISHAY_REV_01  [R_SMD_0805_R_VISHAY_REV01]  (not fitted in variant foxBMS_DC-DC-only)
R302  100R, 1%, 1/10W  100R_0805_R_VISHAY_1%_TK100_REV_01  [R_SMD_0805_R_VISHAY_REV01]  (not fitted in variant foxBMS_DC-DC-only)
R303  100R, 1%, 1/10W  100R_0805_R_VISHAY_1%_TK100_REV_01  [R_SMD_0805_R_VISHAY_REV01]  (not fitted in variant foxBMS_DC-DC-only)
R304  120R, 1%, 1/10W  120R_0603_R_VISHAY_1%_TK100_REV_01  [R_SMD_0603_R_VISHAY_REV01]  (not fitted in variant foxBMS_DC-DC-only)
R305  330R, 1%, 1/10W  330R_0603_R_VISHAY_1%_TK100_REV_01  [R_SMD_0603_R_VISHAY_REV01]  (not fitted in variant foxBMS_Debug)  (not fitted in variant foxBMS_DC-DC-only)
R306  820R, 1%, 1/10W  820R_0603_R_VISHAY_1%_TK100_REV_01  [R_SMD_0603_R_VISHAY_REV01]  (not fitted in variant foxBMS_DC-DC-only)
R307  120R, 1%, 1/10W  120R_0603_R_VISHAY_1%_TK100_REV_01  [R_SMD_0603_R_VISHAY_REV01]  (not fitted in variant foxBMS_DC-DC-only)
R308  1.21k, 1%, 1/10W  1,21K_0603_R_VISHAY_1%_TK100_REV_01  [R_SMD_0603_R_VISHAY_REV01]  (not fitted in variant foxBMS_DC-DC-only)
R309  OPT  0,00R_0603_R_VISHAY_REV_01  [R_SMD_0603_R_VISHAY_REV01]  (not fitted in variant foxBMS_Standard)  (not fitted in variant foxBMS_Debug)  (not fitted in variant foxBMS_DC-DC-only)
R310  0R  0,00R_0603_R_VISHAY_REV_01  [R_SMD_0603_R_VISHAY_REV01]  (not fitted in variant foxBMS_Debug)  (not fitted in variant foxBMS_DC-DC-only)
R311  OPT  0,00R_0603_R_VISHAY_REV_01  [R_SMD_0603_R_VISHAY_REV01]  (not fitted in variant foxBMS_Standard)  (not fitted in variant foxBMS_Debug)  (not fitted in variant foxBMS_DC-DC-only)
R312  0R  0,00R_0603_R_VISHAY_REV_01  [R_SMD_0603_R_VISHAY_REV01]  (not fitted in variant foxBMS_Debug)  (not fitted in variant foxBMS_DC-DC-only)
R313  OPT  0,00R_0603_R_VISHAY_REV_01  [R_SMD_0603_R_VISHAY_REV01]  (not fitted in variant foxBMS_Standard)  (not fitted in variant foxBMS_Debug)  (not fitted in variant foxBMS_DC-DC-only)
R314  0R  0,00R_0603_R_VISHAY_REV_01  [R_SMD_0603_R_VISHAY_REV01]  (not fitted in variant foxBMS_Debug)  (not fitted in variant foxBMS_DC-DC-only)
R315  OPT  0,00R_0603_R_VISHAY_REV_01  [R_SMD_0603_R_VISHAY_REV01]  (not fitted in variant foxBMS_Standard)  (not fitted in variant foxBMS_Debug)  (not fitted in variant foxBMS_DC-DC-only)
R316  0R  0,00R_0603_R_VISHAY_REV_01  [R_SMD_0603_R_VISHAY_REV01]  (not fitted in variant foxBMS_Debug)  (not fitted in variant foxBMS_DC-DC-only)
R317  OPT  0,00R_0603_R_VISHAY_REV_01  [R_SMD_0603_R_VISHAY_REV01]  (not fitted in variant foxBMS_Standard)  (not fitted in variant foxBMS_Debug)  (not fitted in variant foxBMS_DC-DC-only)
R318  0R  0,00R_0603_R_VISHAY_REV_01  [R_SMD_0603_R_VISHAY_REV01]  (not fitted in variant foxBMS_Debug)  (not fitted in variant foxBMS_DC-DC-only)
R319  1M, 10%, 1/10W  1,00M_0603_R_VISHAY_1%_TK100_REV_01  [R_SMD_0603_R_VISHAY_REV01]  (not fitted in variant foxBMS_Debug)  (not fitted in variant foxBMS_DC-DC-only)
R320  0R  0,00R_0603_R_VISHAY_REV_01  [R_SMD_0603_R_VISHAY_REV01]  (not fitted in variant foxBMS_Debug)  (not fitted in variant foxBMS_DC-DC-only)
R321  OPT  0,00R_0603_R_VISHAY_REV_01  [R_SMD_0603_R_VISHAY_REV01]  (not fitted in variant foxBMS_Standard)  (not fitted in variant foxBMS_Debug)  (not fitted in variant foxBMS_DC-DC-only)
R322  1.2k, 10%, 1/10W  1,20K_0603_R_VISHAY_1%_TK100_REV_01  [R_SMD_0603_R_VISHAY_REV01]  (not fitted in variant foxBMS_Debug)  (not fitted in variant foxBMS_DC-DC-only)
R323  1.2k, 10%, 1/10W  1,20K_0603_R_VISHAY_1%_TK100_REV_01  [R_SMD_0603_R_VISHAY_REV01]  (not fitted in variant foxBMS_Debug)  (not fitted in variant foxBMS_DC-DC-only)
T301  PBHV8115Z  [D_SMD_SOT223_(SC-73)_R_NXP_REV01]  (not fitted in variant foxBMS_DC-DC-only)
TP301  CUSTOM_PAD_PAD_2.0X1.5MM  [CUSTOM_PAD_PAD2.0X1.5MM]  (not fitted in variant foxBMS_Standard)  (not fitted in variant foxBMS_Debug)  (not fitted in variant foxBMS_DC-DC-only)
TP303  CUSTOM_PAD_PAD_2.0X1.5MM  [CUSTOM_PAD_PAD2.0X1.5MM]  (not fitted in variant foxBMS_Standard)  (not fitted in variant foxBMS_Debug)  (not fitted in variant foxBMS_DC-DC-only)
TP304  CUSTOM_PAD_PAD_2.0X1.5MM  [CUSTOM_PAD_PAD2.0X1.5MM]  (not fitted in variant foxBMS_Standard)  (not fitted in variant foxBMS_Debug)  (not fitted in variant foxBMS_DC-DC-only)
TP305  CUSTOM_PAD_PAD_2.0X1.5MM  [CUSTOM_PAD_PAD2.0X1.5MM]  (not fitted in variant foxBMS_Standard)  (not fitted in variant foxBMS_Debug)  (not fitted in variant foxBMS_DC-DC-only)
TP306  CUSTOM_PAD_PAD_2.0X1.5MM  [CUSTOM_PAD_PAD2.0X1.5MM]  (not fitted in variant foxBMS_Debug)  (not fitted in variant foxBMS_DC-DC-only)
TP307  CUSTOM_PAD_PAD_2.0X1.5MM  [CUSTOM_PAD_PAD2.0X1.5MM]  (not fitted in variant foxBMS_Standard)  (not fitted in variant foxBMS_Debug)  (not fitted in variant foxBMS_DC-DC-only)
TP309  CUSTOM_PAD_PAD_2.0X1.5MM  [CUSTOM_PAD_PAD2.0X1.5MM]  (not fitted in variant foxBMS_Debug)  (not fitted in variant foxBMS_DC-DC-only)
TP310  CUSTOM_PAD_PAD_2.0X1.5MM  [CUSTOM_PAD_PAD2.0X1.5MM]  (not fitted in variant foxBMS_Debug)  (not fitted in variant foxBMS_DC-DC-only)
TR301  HM2102NL  [HM2102NL]  (not fitted in variant foxBMS_DC-DC-only)

### Nets
+3.0V_VREF1_1: C306.2 IC301.35(-PWR:VREF1) TP303.P$1(MP)
+3.0V_VREF2_1: C305.2 IC301.34(-PWR:VREF2) TP304.P$1(MP) ; also sheet 10,15
+5.0V_VREG_1: C303.2 IC301.37(-PWR:VREG) IC301.40(-CONTROL:ISOMD) LD301.A R319.2 R321.2 R322.2 R323.2 T301.3(E) TP305.P$1(MP) ; also sheet 8,10,12,14,15
EXT_DC_ISO+: D301.K(C) D302.C(K2) R302.2 R303.1 ; also sheet 2,16
FUSED_VBAT+: R301.1 ; also sheet 2,4
FUSED_VBAT-: C301.P$2 C302.P$2 C303.1 C304.1 C305.1 C306.1 C307.1 D302.A(K1) IC301.30(-PWR:V-1) IC301.31(-PWR:V-2) R305.1 R308.1 R320.1 TP306.P$1(MP) ; also sheet 2,4,5,6,8,9,10,11,12,13,14,15,16
GLOBAL-BALANCING-FEEDBACK: R314.1 ; also sheet 2,8
N$14: C307.2 TR301.11(-1:CMT)
N$15: C304.2 TR301.8(-2:CMT)
N$24: C302.P$1 IC301.1(-PWR:V+) R303.2
N$25: C301.P$1 R302.1 T301.2(C) T301.4(C)
N$26: IC301.38(-PWR:DRIVE) T301.1(B)
N$33: IC301.45(-COM:IBIAS) R306.2
N$38: LD301.C R305.2
N$40: IC301.32(-GPIO:GPIO4) R315.2 R316.2
N$96: D301.A R301.2
PRIMARY-ICMP1: IC301.46(-COM:ICMP) R306.1 R308.2
PRIMARY-SWTEN1: IC301.36(-CONTROL:SWTEN) R320.2 R321.1
SECONDARY-C0: IC301.26(-CELL_INPUTS:C0) ; also sheet 6
SECONDARY-C1: IC301.24(-CELL_INPUTS:C1) ; also sheet 6
SECONDARY-C2: IC301.22(-CELL_INPUTS:C2) ; also sheet 6
SECONDARY-C3: IC301.20(-CELL_INPUTS:C3) ; also sheet 6
SECONDARY-C4: IC301.18(-CELL_INPUTS:C4) ; also sheet 6
SECONDARY-C5: IC301.16(-CELL_INPUTS:C5) ; also sheet 6
SECONDARY-C6: IC301.14(-CELL_INPUTS:C6) ; also sheet 6
SECONDARY-C7: IC301.12(-CELL_INPUTS:C7) ; also sheet 6
SECONDARY-C8: IC301.10(-CELL_INPUTS:C8) ; also sheet 6
SECONDARY-C9: IC301.8(-CELL_INPUTS:C9) ; also sheet 6
SECONDARY-C10: IC301.6(-CELL_INPUTS:C10) ; also sheet 6
SECONDARY-C11: IC301.4(-CELL_INPUTS:C11) ; also sheet 6
SECONDARY-C12: IC301.2(-CELL_INPUTS:C12) ; also sheet 6
SECONDARY-GPIO0: IC301.27(-GPIO:GPIO1) R309.2 R310.2
SECONDARY-GPIO1: IC301.28(-GPIO:GPIO2) R311.2 R312.2
SECONDARY-GPIO1-OPT: R309.1 ; also sheet 15
SECONDARY-GPIO2-OPT: R311.1 ; also sheet 15
SECONDARY-GPIO3-OPT: R313.1 ; also sheet 15
SECONDARY-GPIO4: IC301.33(-GPIO:GPIO5) R317.2 R318.2
SECONDARY-GPIO4-OPT: R315.1 ; also sheet 15
SECONDARY-GPIO5: IC301.29(-GPIO:GPIO3) R313.2 R314.2
SECONDARY-GPIO5-OPT: R317.1 ; also sheet 15
SECONDARY-IN+: TP301.P$1(MP) TR301.4(-2:D+) ; also sheet 15
SECONDARY-IN-: TR301.6(-2:D-) ; also sheet 15
SECONDARY-IN_N1 [DiffPair]: IC301.41(-COM:CSB/IMA) R304.2 TR301.7(-2:X-)
SECONDARY-IN_P1 [DiffPair]: IC301.42(-COM:SCK/IPA) R304.1 TR301.9(-2:X+)
SECONDARY-MUX-DATA_TEMP: R310.1 ; also sheet 10
SECONDARY-MUX-DATA_USER: R312.1 ; also sheet 10
SECONDARY-OUT+: TP307.P$1(MP) TR301.1(-1:D+) ; also sheet 15
SECONDARY-OUT-: TR301.3(-1:D-) ; also sheet 15
SECONDARY-OUT_N1 [DiffPair]: IC301.47(-COM:IMB) R307.2 TR301.10(-1:X-)
SECONDARY-OUT_P1 [DiffPair]: IC301.48(-COM:IPB) R307.1 TR301.12(-1:X+)
SECONDARY-SCL_1: R318.1 R323.1 TP310.P$1(MP) ; also sheet 10,12,14
SECONDARY-SDA_1: R316.1 R322.1 TP309.P$1(MP) ; also sheet 10,12,14
SECONDARY-WDT: IC301.39(-CONTROL:WDT) R319.1 ; also sheet 15
Unconnected: IC301.3(-BALANCE:S12) IC301.5(-BALANCE:S11) IC301.7(-BALANCE:S10) IC301.9(-BALANCE:S9) IC301.11(-BALANCE:S8) IC301.13(-BALANCE:S7) IC301.15(-BALANCE:S6) IC301.17(-BALANCE:S5) IC301.19(-BALANCE:S4) IC301.21(-BALANCE:S3) IC301.23(-BALANCE:S2) IC301.25(-BALANCE:S1) IC301.43(-COM:SDI/NC) IC301.44(-COM:SDO/NC) TR301.2(-1:CT) TR301.5(-2:CT)

### Notes on the sheet
- Power Supply | Setting Pins
- Watchdog timer pull-up
- communication mode (ISOMD connected to VREG = isoSPI)
- 100V | 100V
- optional
- Software timer configuration:
  Pull-up: on 
  Pull-down: off (standard)
- min. 66.7V
  max. 73.7V @ 1mA
- LED on: LTC in STANDBY, REFUP or MEASURE mode
  LED off: LTC in SLEEP mode
- optional
- R309: GPIO1 connected to pin header
  R310: GPIO1 connected to temperature MUX
- optional
- R311: GPIO2 connected to pin header
  R312: GPIO2 connected to user MUX
- Cell voltage sense inputs | Cell balancing control | GPIO Pins
- optional
- R313: GPIO3 connected to pin header
  R314: GPIO3 connected to balancing feedback
- Cell balancing control
  (not used on secondary)
- optional
- I2C Pullups
- R315: GPIO4 connected to pin header
  R316: GPIO4 connected to I2C SDA
- optional
- R317: GPIO5 connected to pin header
  R318: GPIO5 connected to I2C SCL
- Communication Circuit
- differential signal voltage amplitude adjustment
- SPI not used
- isolation transformer | SPI not used | isolation transformer
- previous LTC6804/LTC6811
  in daisy-chain
- next LTC6804/LTC6811
  in daisy-chain
- Layout:
- - The transformer should be placed as close to the isoSPI cable connector as possible.
- The distance should be kept less than 2cm.
- - The LTC6804 should be placed at least 1cm to 2cm away from the transformer.
- Secondary LTC6804/LTC6811
- - On the top component layer, no ground plane should be placed under the transformer,
- the isoSPI connector, or in between the transformer and the connector.
- - The isoSPI signal traces should be isolated from surrounding circuits and traces by ground metal or space.
- No traces should cross the isoSPI signal lines, unless separated by a ground plane on an inner layer.

## Sheet 4 of 17: Cell Voltage Sense Fuses
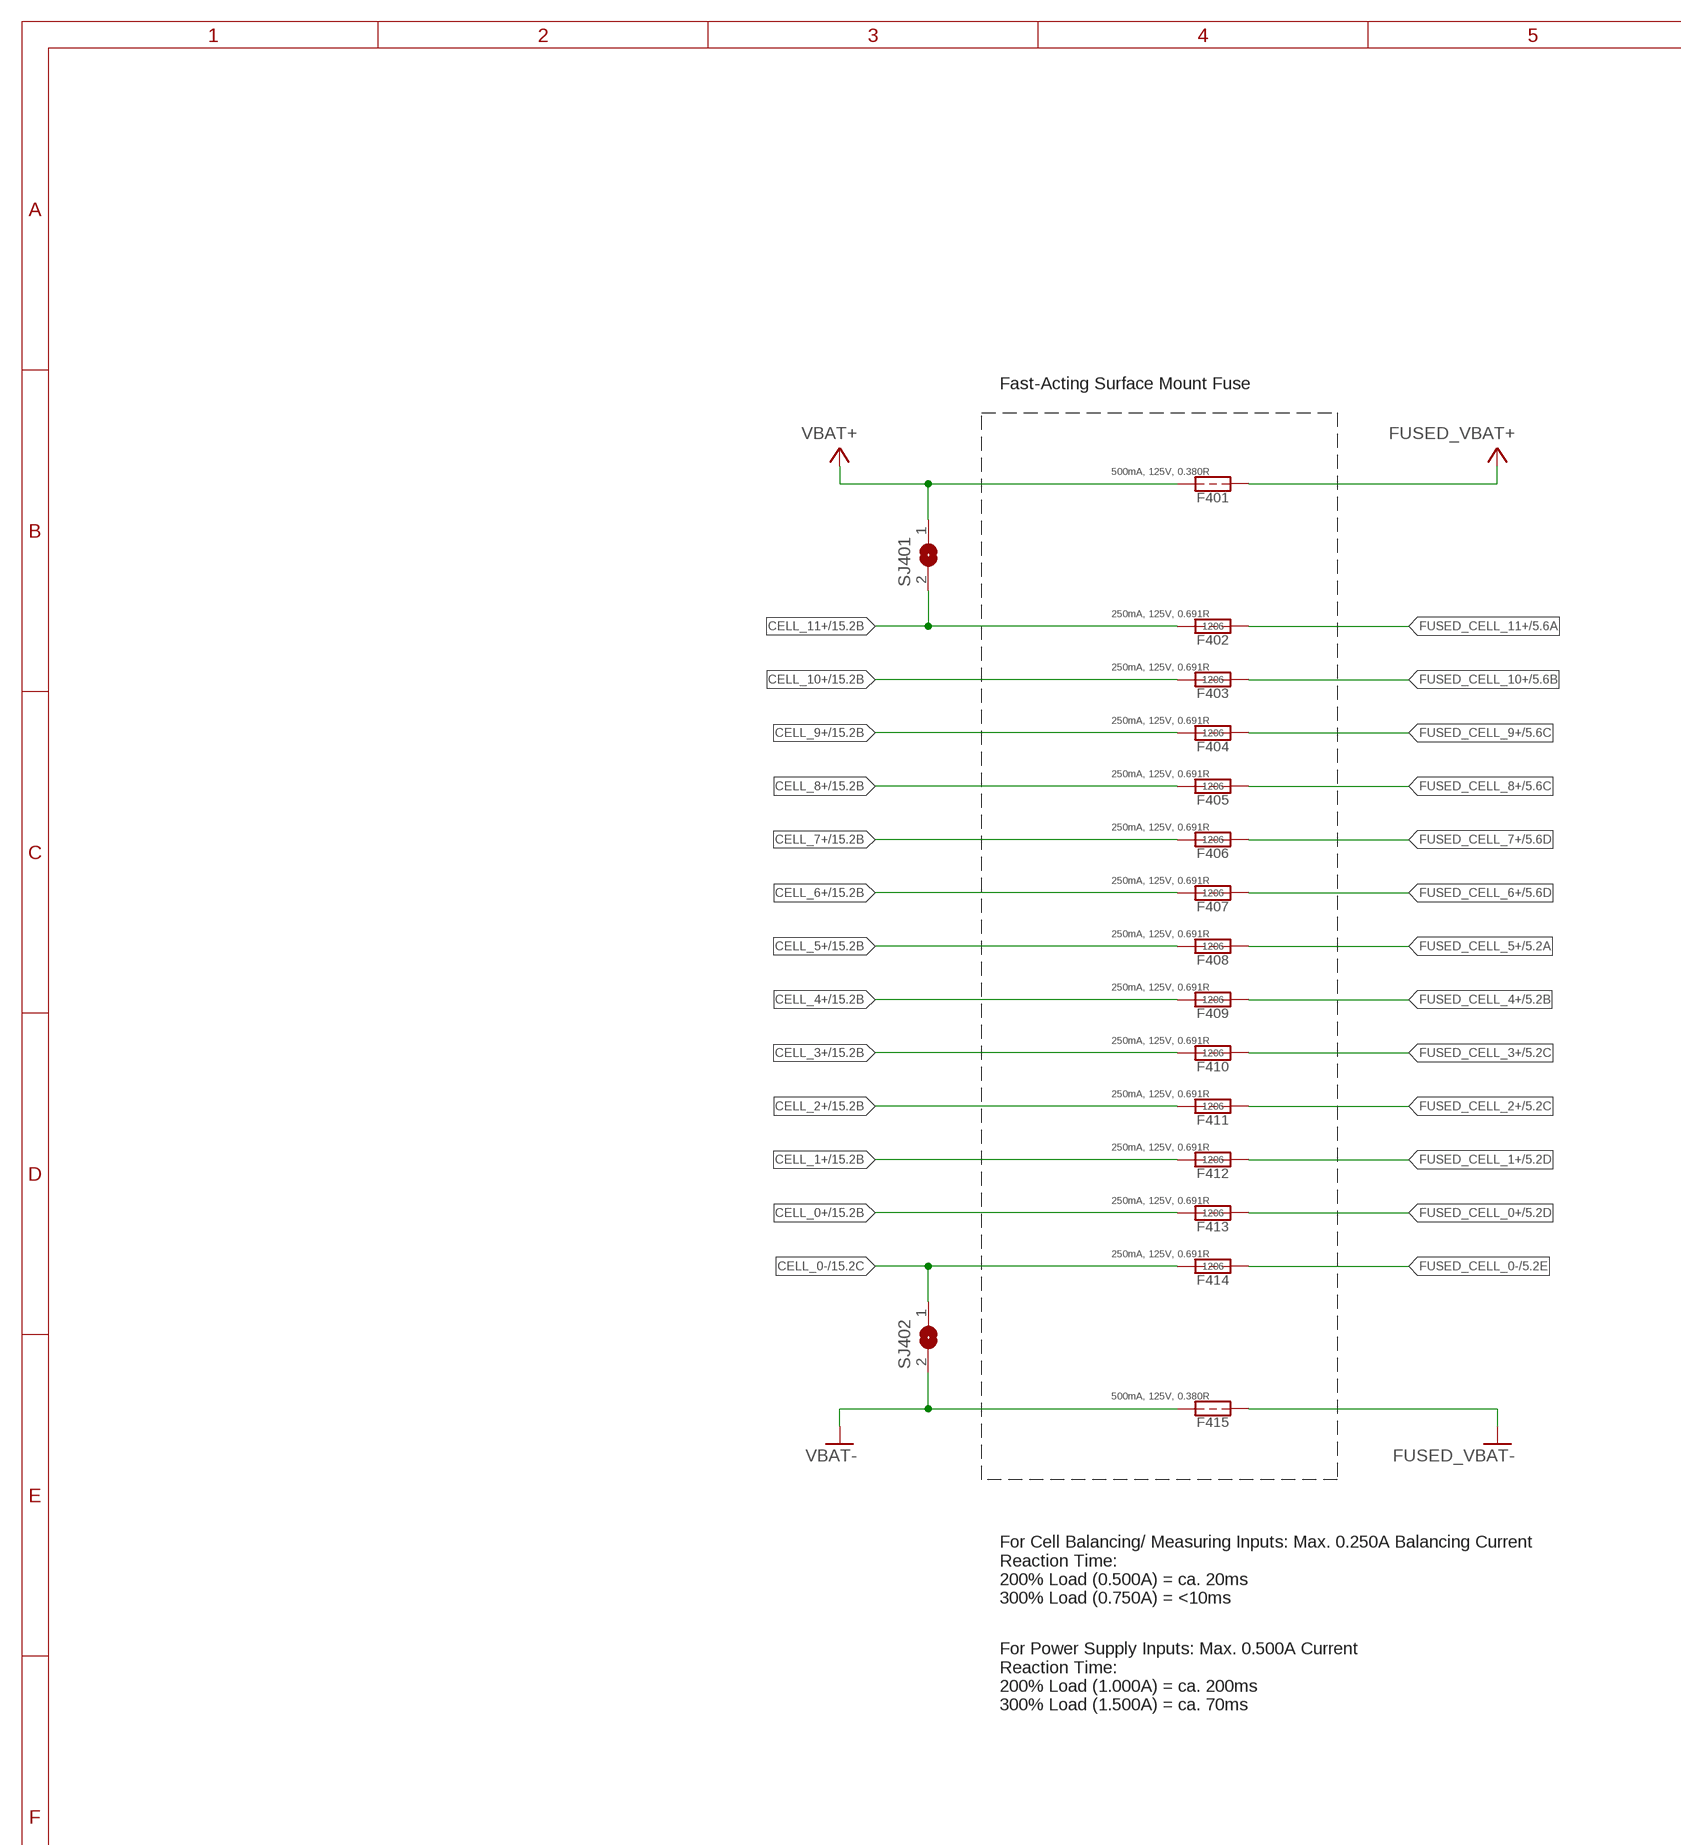
[diagram p5: schematic, sheet 4, part 1 of 2]
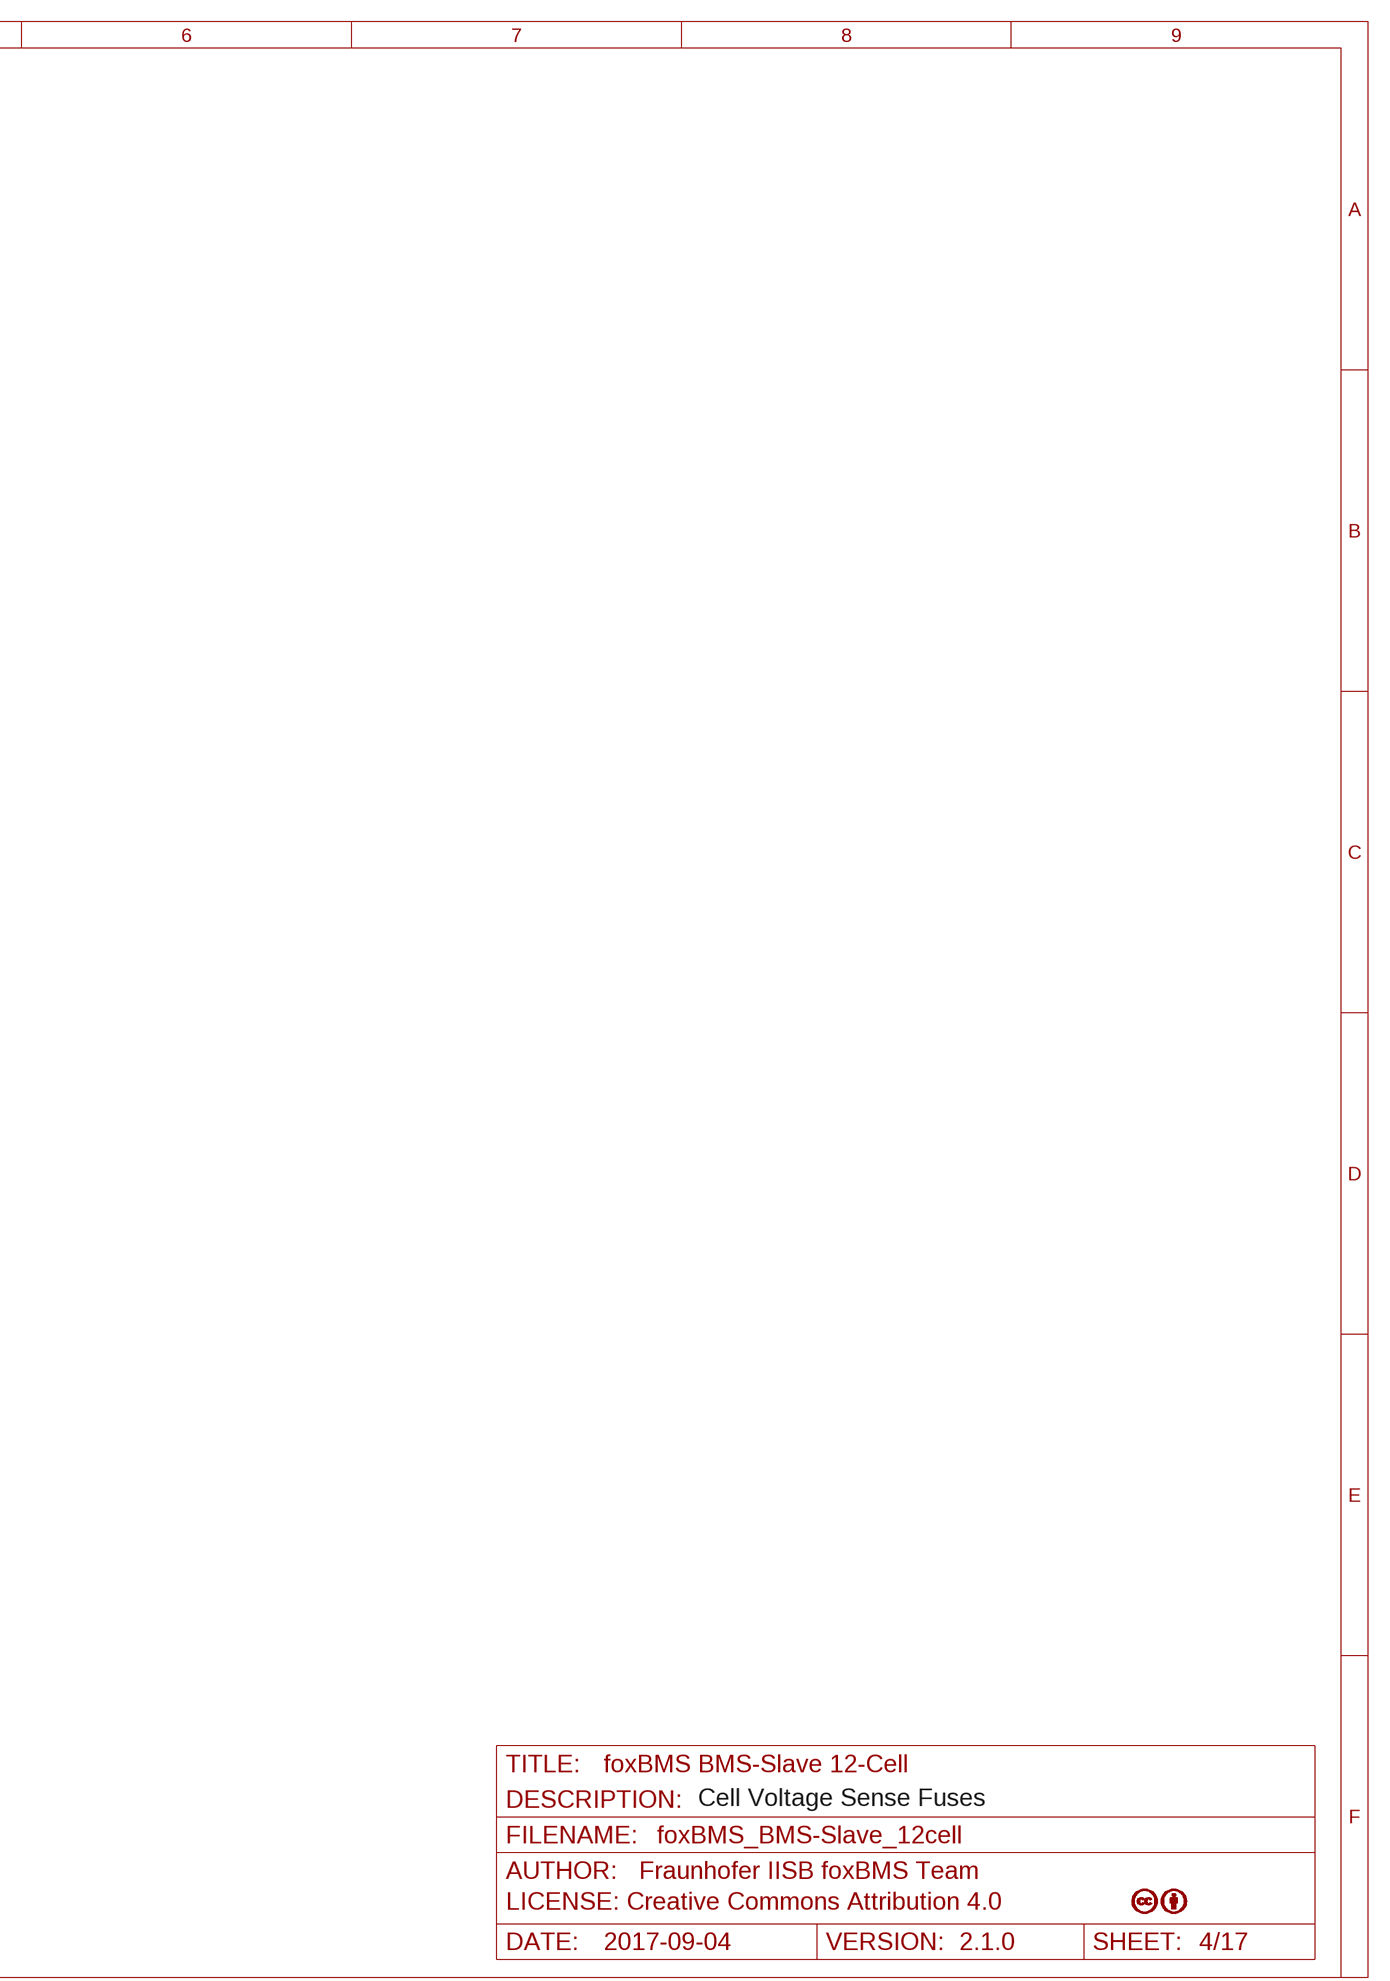
[diagram p6: schematic, sheet 4, part 2 of 2]

### Parts
F401  0.5A, 63V, 0.25R  0,500A_LITTELFUSE_448  [448_SERIES_LITTELFUSE]  (not fitted in variant foxBMS_DC-DC-only)
F402  FUSE: 0.250A, 32V, 0.57R  0,250A_LITTELFUSE_466_1206  [R_SMD_CHIP_1206_R_LITTLEFUSE_REV_01]  (not fitted in variant foxBMS_DC-DC-only)
F403  FUSE: 0.250A, 32V, 0.57R  0,250A_LITTELFUSE_466_1206  [R_SMD_CHIP_1206_R_LITTLEFUSE_REV_01]  (not fitted in variant foxBMS_DC-DC-only)
F404  FUSE: 0.250A, 32V, 0.57R  0,250A_LITTELFUSE_466_1206  [R_SMD_CHIP_1206_R_LITTLEFUSE_REV_01]  (not fitted in variant foxBMS_DC-DC-only)
F405  FUSE: 0.250A, 32V, 0.57R  0,250A_LITTELFUSE_466_1206  [R_SMD_CHIP_1206_R_LITTLEFUSE_REV_01]  (not fitted in variant foxBMS_DC-DC-only)
F406  FUSE: 0.250A, 32V, 0.57R  0,250A_LITTELFUSE_466_1206  [R_SMD_CHIP_1206_R_LITTLEFUSE_REV_01]  (not fitted in variant foxBMS_DC-DC-only)
F407  FUSE: 0.250A, 32V, 0.57R  0,250A_LITTELFUSE_466_1206  [R_SMD_CHIP_1206_R_LITTLEFUSE_REV_01]  (not fitted in variant foxBMS_DC-DC-only)
F408  FUSE: 0.250A, 32V, 0.57R  0,250A_LITTELFUSE_466_1206  [R_SMD_CHIP_1206_R_LITTLEFUSE_REV_01]  (not fitted in variant foxBMS_DC-DC-only)
F409  FUSE: 0.250A, 32V, 0.57R  0,250A_LITTELFUSE_466_1206  [R_SMD_CHIP_1206_R_LITTLEFUSE_REV_01]  (not fitted in variant foxBMS_DC-DC-only)
F410  FUSE: 0.250A, 32V, 0.57R  0,250A_LITTELFUSE_466_1206  [R_SMD_CHIP_1206_R_LITTLEFUSE_REV_01]  (not fitted in variant foxBMS_DC-DC-only)
F411  FUSE: 0.250A, 32V, 0.57R  0,250A_LITTELFUSE_466_1206  [R_SMD_CHIP_1206_R_LITTLEFUSE_REV_01]  (not fitted in variant foxBMS_DC-DC-only)
F412  FUSE: 0.250A, 32V, 0.57R  0,250A_LITTELFUSE_466_1206  [R_SMD_CHIP_1206_R_LITTLEFUSE_REV_01]  (not fitted in variant foxBMS_DC-DC-only)
F413  FUSE: 0.250A, 32V, 0.57R  0,250A_LITTELFUSE_466_1206  [R_SMD_CHIP_1206_R_LITTLEFUSE_REV_01]  (not fitted in variant foxBMS_DC-DC-only)
F414  FUSE: 0.250A, 32V, 0.57R  0,250A_LITTELFUSE_466_1206  [R_SMD_CHIP_1206_R_LITTLEFUSE_REV_01]  (not fitted in variant foxBMS_DC-DC-only)
F415  0.5A, 63V, 0.25R  0,500A_LITTELFUSE_448  [448_SERIES_LITTELFUSE]  (not fitted in variant foxBMS_DC-DC-only)
SJ401  SJ  [SJ]  (not fitted in variant foxBMS_Debug)  (not fitted in variant foxBMS_DC-DC-only)
SJ402  SJ  [SJ]  (not fitted in variant foxBMS_Debug)  (not fitted in variant foxBMS_DC-DC-only)

### Nets
CELL_0+: F413.P$1 ; also sheet 15
CELL_0-: F414.P$1 SJ402.1 ; also sheet 15
CELL_1+: F412.P$1 ; also sheet 15
CELL_2+: F411.P$1 ; also sheet 15
CELL_3+: F410.P$1 ; also sheet 15
CELL_4+: F409.P$1 ; also sheet 15
CELL_5+: F408.P$1 ; also sheet 15
CELL_6+: F407.P$1 ; also sheet 15
CELL_7+: F406.P$1 ; also sheet 15
CELL_8+: F405.P$1 ; also sheet 15
CELL_9+: F404.P$1 ; also sheet 15
CELL_10+: F403.P$1 ; also sheet 15
CELL_11+: F402.P$1 SJ401.2 ; also sheet 15
FUSED_CELL_0+: F413.P$2 ; also sheet 5,6,7,8
FUSED_CELL_0-: F414.P$2 ; also sheet 5,6,7,8
FUSED_CELL_1+: F412.P$2 ; also sheet 5,6,7,8
FUSED_CELL_2+: F411.P$2 ; also sheet 5,6,7,8
FUSED_CELL_3+: F410.P$2 ; also sheet 5,6,7,8
FUSED_CELL_4+: F409.P$2 ; also sheet 5,6,7,8
FUSED_CELL_5+: F408.P$2 ; also sheet 5,6,7,8
FUSED_CELL_6+: F407.P$2 ; also sheet 5,6,7,8
FUSED_CELL_7+: F406.P$2 ; also sheet 5,6,7,8
FUSED_CELL_8+: F405.P$2 ; also sheet 5,6,7,8
FUSED_CELL_9+: F404.P$2 ; also sheet 5,6,7,8
FUSED_CELL_10+: F403.P$2 ; also sheet 5,6,7,8
FUSED_CELL_11+: F402.P$2 ; also sheet 5,6,7
FUSED_VBAT+: F401.P$2 ; also sheet 2,3
FUSED_VBAT-: F415.P$2 ; also sheet 2,3,5,6,8,9,10,11,12,13,14,15,16
VBAT+: F401.P$1 SJ401.1 ; also sheet 15
VBAT-: F415.P$1 SJ402.2 ; also sheet 15

### Notes on the sheet
- Fast-Acting Surface Mount Fuse
- For Cell Balancing/ Measuring Inputs: Max. 0.250A Balancing Current 
  Reaction Time: 
  200% Load (0.500A) = ca. 20ms
  300% Load (0.750A) = <10ms
- For Power Supply Inputs: Max. 0.500A Current 
  Reaction Time:
  200% Load (1.000A) = ca. 200ms
  300% Load (1.500A) = ca. 70ms
- Cell Voltage Sense Fuses

## Sheet 5 of 17: Primary Voltage Measurement
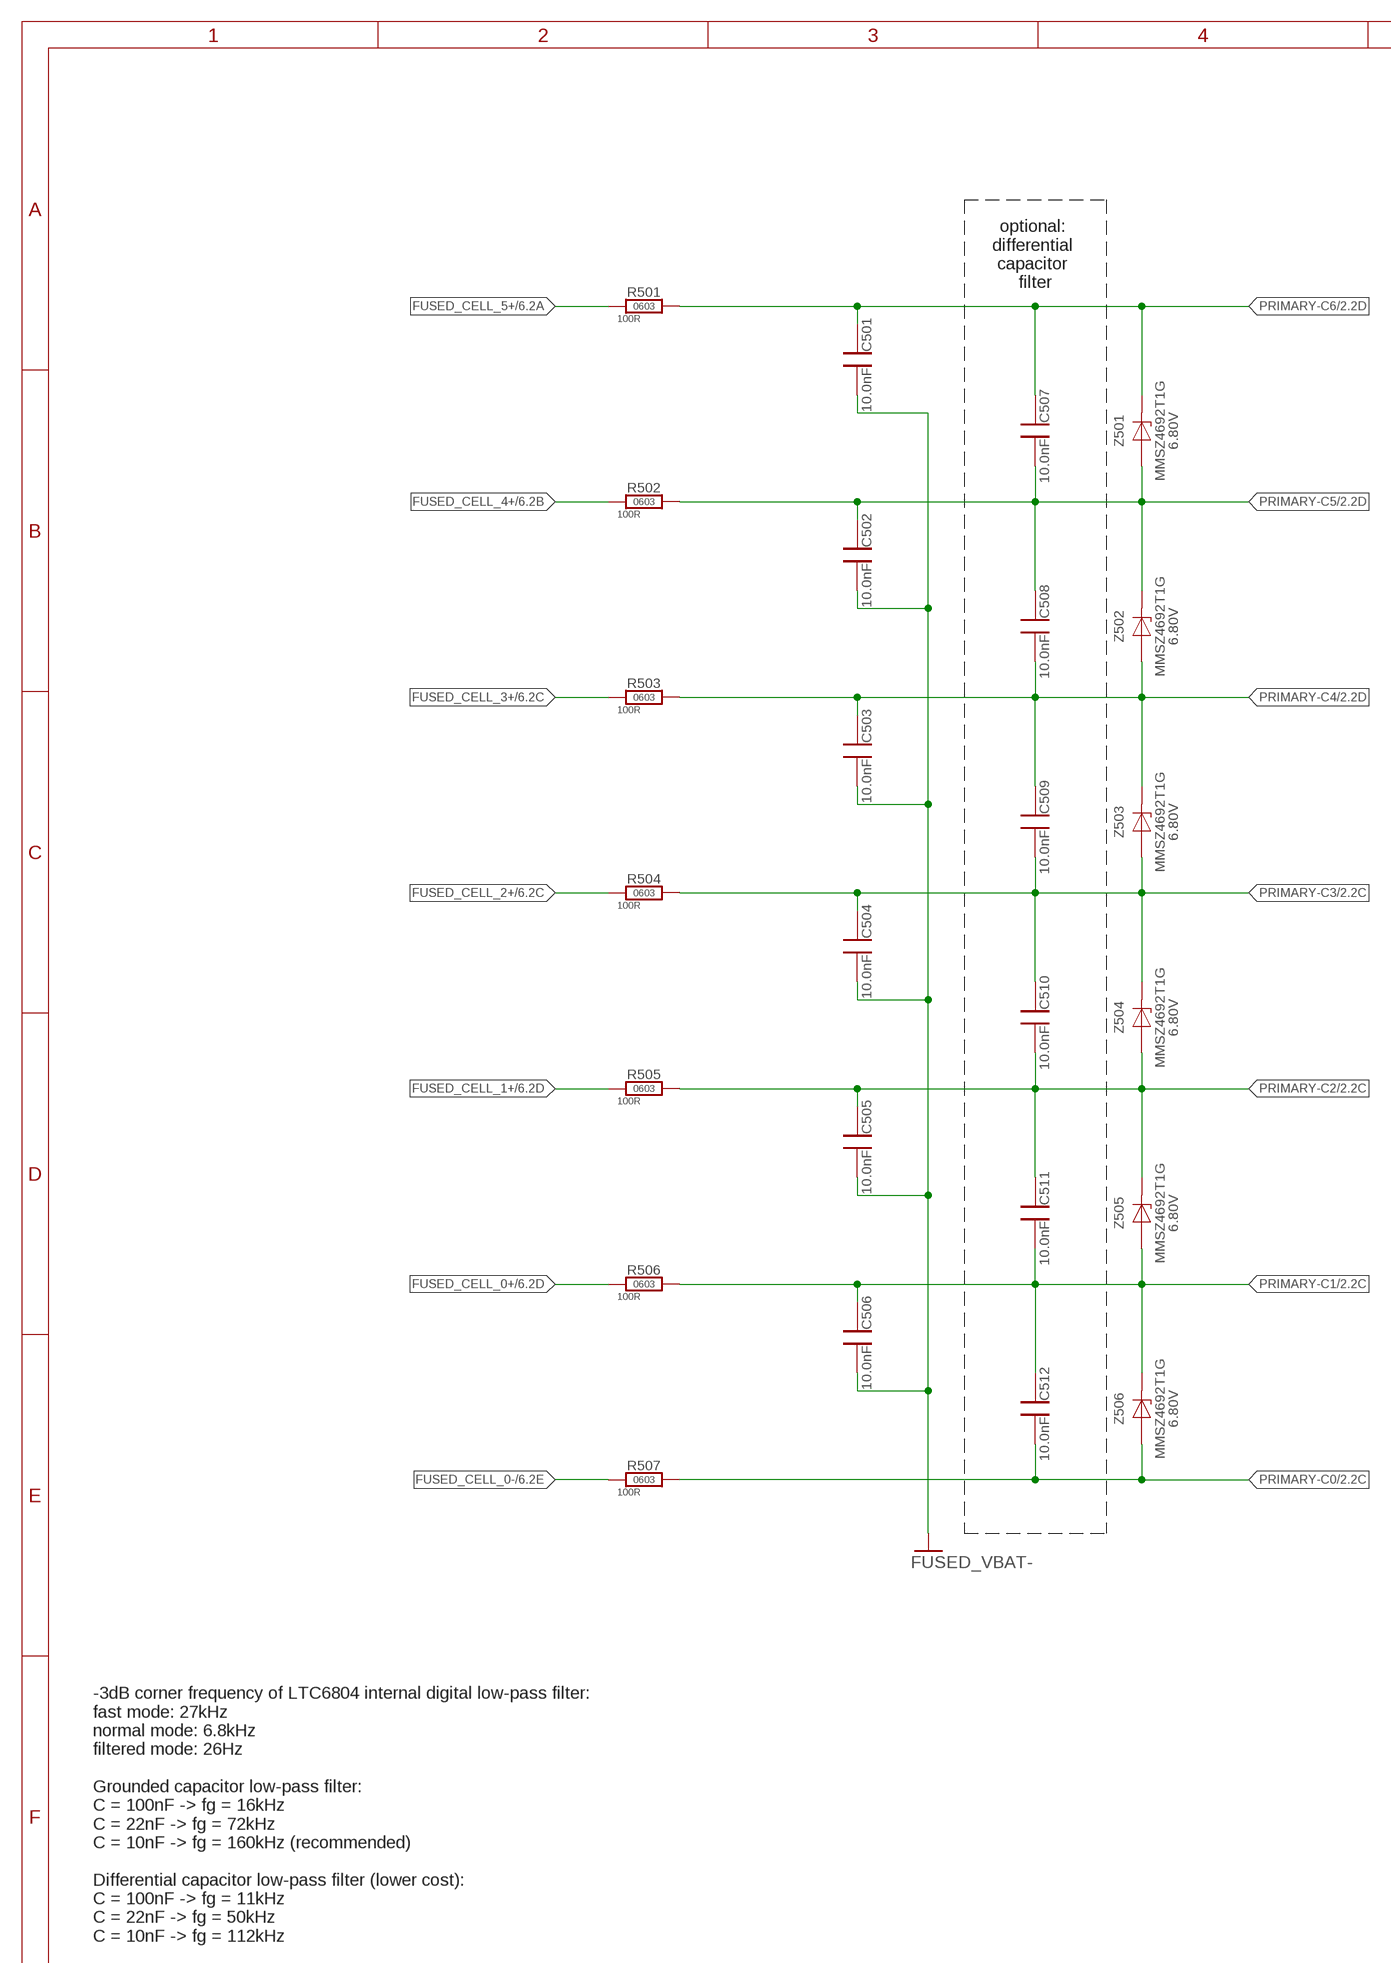
[diagram p7: schematic, sheet 5, part 1 of 2]
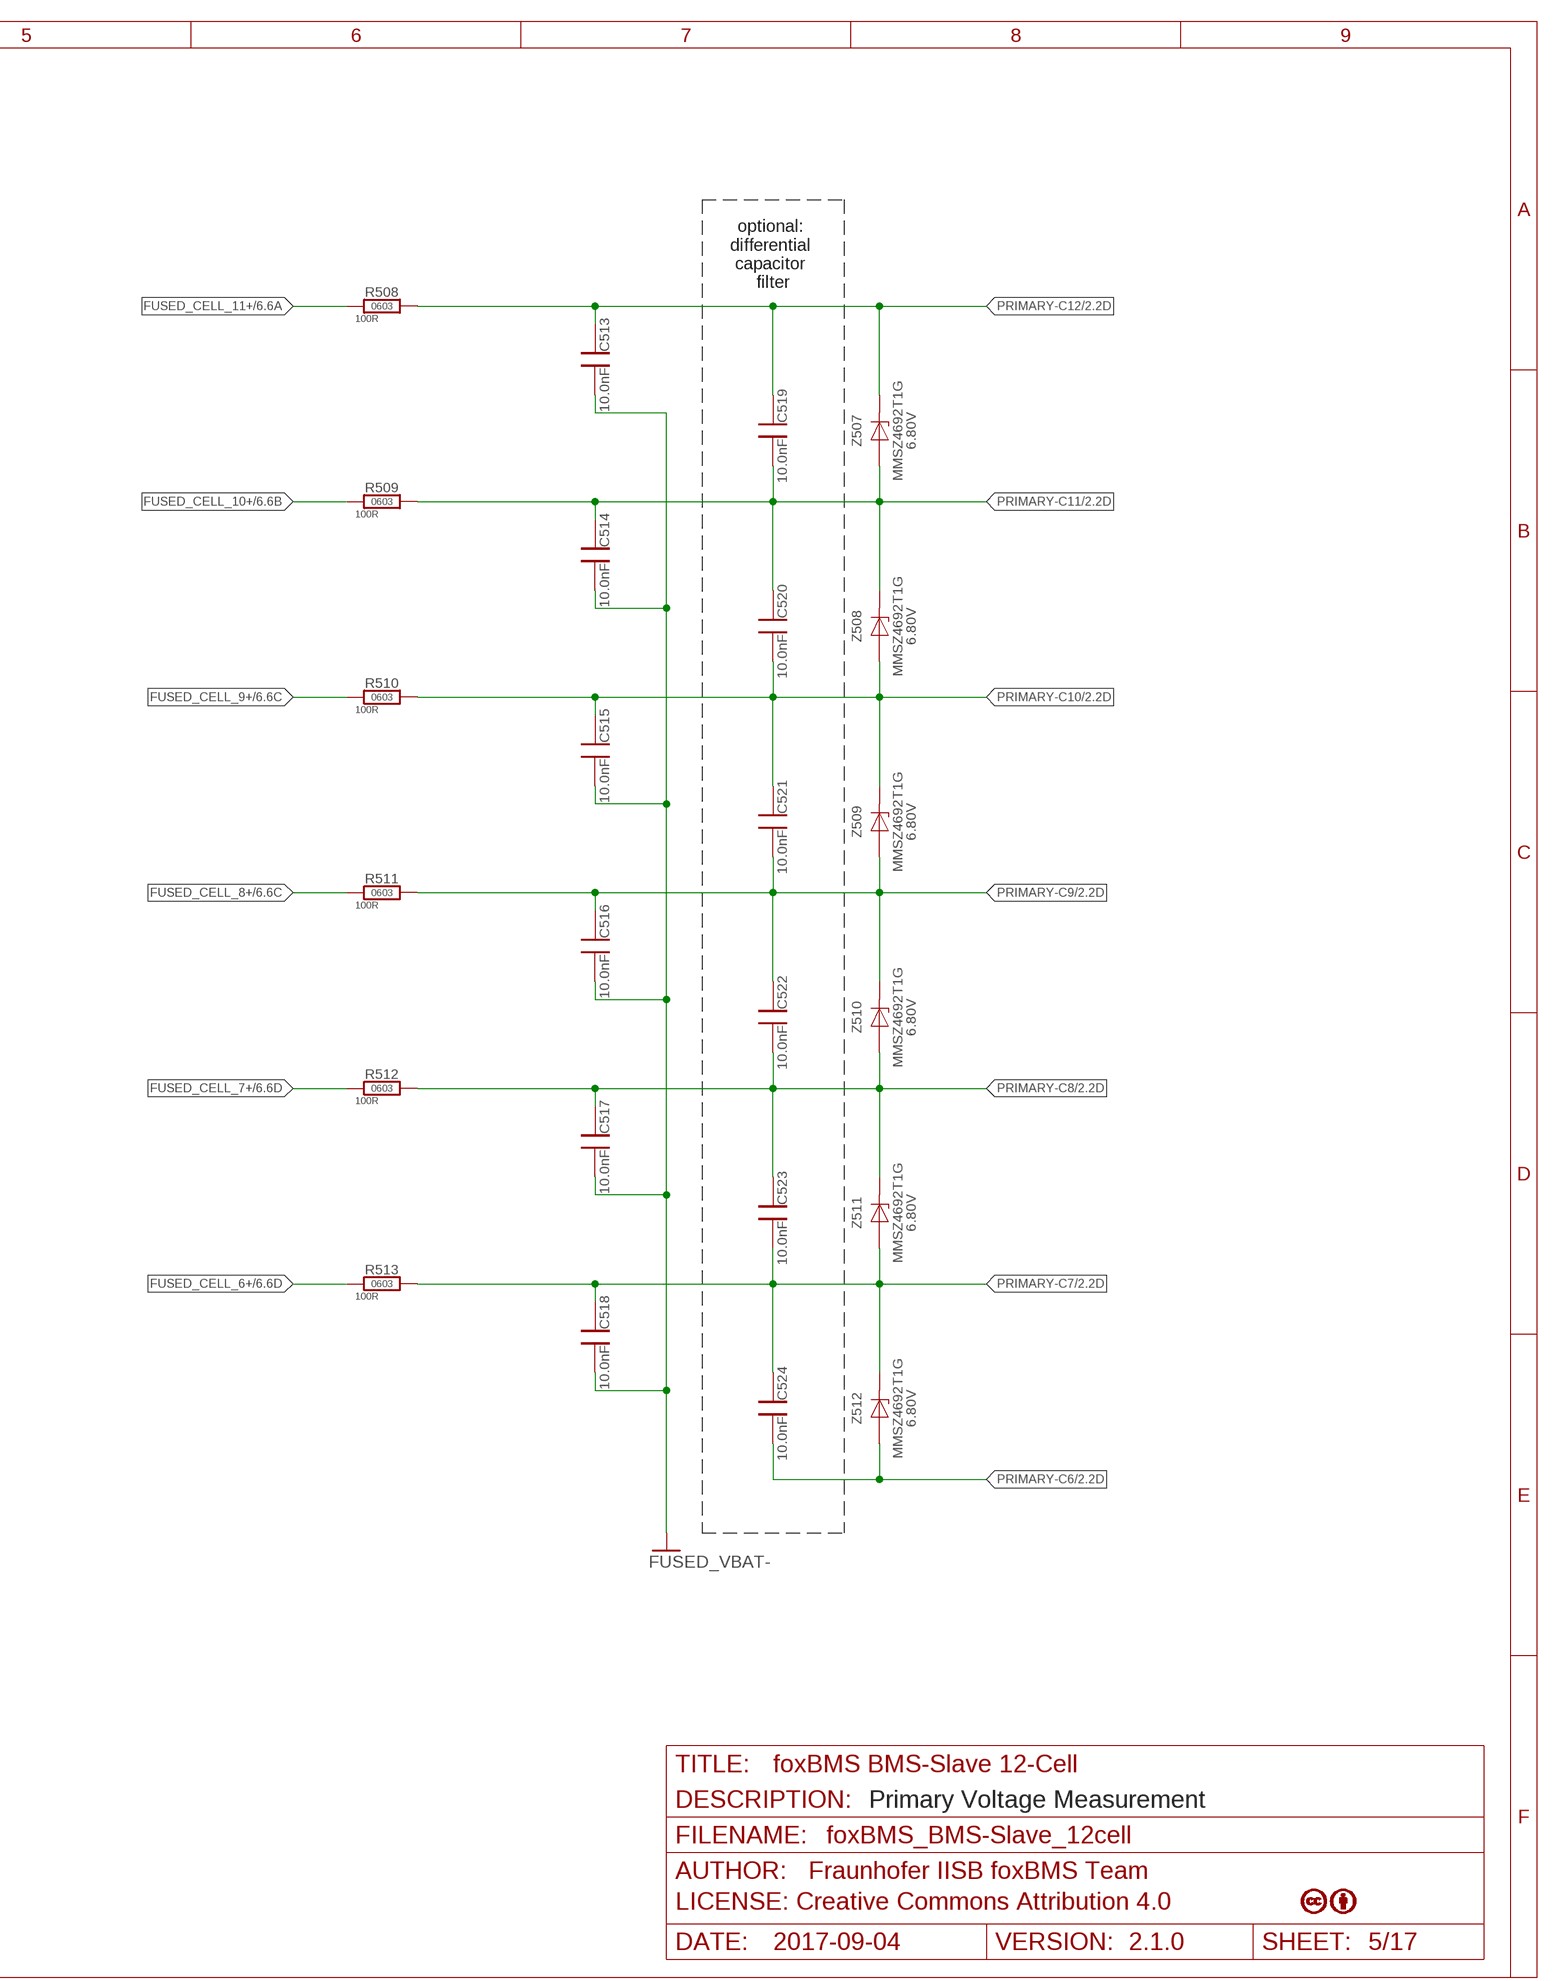
[diagram p8: schematic, sheet 5, part 2 of 2]

### Parts
C501  10nF, 100V, 10%  10,0NF_0603__100V_X7R_KEMET  [C_SMD_0603_(1608)_R_KEMET_REV01]  (not fitted in variant foxBMS_Debug)  (not fitted in variant foxBMS_DC-DC-only)
C502  10nF, 100V, 10%  10,0NF_0603__100V_X7R_KEMET  [C_SMD_0603_(1608)_R_KEMET_REV01]  (not fitted in variant foxBMS_Debug)  (not fitted in variant foxBMS_DC-DC-only)
C503  10nF, 100V, 10%  10,0NF_0603__100V_X7R_KEMET  [C_SMD_0603_(1608)_R_KEMET_REV01]  (not fitted in variant foxBMS_Debug)  (not fitted in variant foxBMS_DC-DC-only)
C504  10nF, 100V, 10%  10,0NF_0603__100V_X7R_KEMET  [C_SMD_0603_(1608)_R_KEMET_REV01]  (not fitted in variant foxBMS_Debug)  (not fitted in variant foxBMS_DC-DC-only)
C505  10nF, 100V, 10%  10,0NF_0603__100V_X7R_KEMET  [C_SMD_0603_(1608)_R_KEMET_REV01]  (not fitted in variant foxBMS_Debug)  (not fitted in variant foxBMS_DC-DC-only)
C506  10nF, 100V, 10%  10,0NF_0603__100V_X7R_KEMET  [C_SMD_0603_(1608)_R_KEMET_REV01]  (not fitted in variant foxBMS_Debug)  (not fitted in variant foxBMS_DC-DC-only)
C507  10nF, 100V, 10%  10,0NF_0603__100V_X7R_KEMET  [C_SMD_0603_(1608)_R_KEMET_REV01]  (not fitted in variant foxBMS_Standard)  (not fitted in variant foxBMS_Debug)  (not fitted in variant foxBMS_DC-DC-only)
C508  10nF, 100V, 10%  10,0NF_0603__100V_X7R_KEMET  [C_SMD_0603_(1608)_R_KEMET_REV01]  (not fitted in variant foxBMS_Standard)  (not fitted in variant foxBMS_Debug)  (not fitted in variant foxBMS_DC-DC-only)
C509  10nF, 100V, 10%  10,0NF_0603__100V_X7R_KEMET  [C_SMD_0603_(1608)_R_KEMET_REV01]  (not fitted in variant foxBMS_Standard)  (not fitted in variant foxBMS_Debug)  (not fitted in variant foxBMS_DC-DC-only)
C510  10nF, 100V, 10%  10,0NF_0603__100V_X7R_KEMET  [C_SMD_0603_(1608)_R_KEMET_REV01]  (not fitted in variant foxBMS_Standard)  (not fitted in variant foxBMS_Debug)  (not fitted in variant foxBMS_DC-DC-only)
C511  10nF, 100V, 10%  10,0NF_0603__100V_X7R_KEMET  [C_SMD_0603_(1608)_R_KEMET_REV01]  (not fitted in variant foxBMS_Standard)  (not fitted in variant foxBMS_Debug)  (not fitted in variant foxBMS_DC-DC-only)
C512  10nF, 100V, 10%  10,0NF_0603__100V_X7R_KEMET  [C_SMD_0603_(1608)_R_KEMET_REV01]  (not fitted in variant foxBMS_Standard)  (not fitted in variant foxBMS_Debug)  (not fitted in variant foxBMS_DC-DC-only)
C513  10nF, 100V, 10%  10,0NF_0603__100V_X7R_KEMET  [C_SMD_0603_(1608)_R_KEMET_REV01]  (not fitted in variant foxBMS_Debug)  (not fitted in variant foxBMS_DC-DC-only)
C514  10nF, 100V, 10%  10,0NF_0603__100V_X7R_KEMET  [C_SMD_0603_(1608)_R_KEMET_REV01]  (not fitted in variant foxBMS_Debug)  (not fitted in variant foxBMS_DC-DC-only)
C515  10nF, 100V, 10%  10,0NF_0603__100V_X7R_KEMET  [C_SMD_0603_(1608)_R_KEMET_REV01]  (not fitted in variant foxBMS_Debug)  (not fitted in variant foxBMS_DC-DC-only)
C516  10nF, 100V, 10%  10,0NF_0603__100V_X7R_KEMET  [C_SMD_0603_(1608)_R_KEMET_REV01]  (not fitted in variant foxBMS_Debug)  (not fitted in variant foxBMS_DC-DC-only)
C517  10nF, 100V, 10%  10,0NF_0603__100V_X7R_KEMET  [C_SMD_0603_(1608)_R_KEMET_REV01]  (not fitted in variant foxBMS_Debug)  (not fitted in variant foxBMS_DC-DC-only)
C518  10nF, 100V, 10%  10,0NF_0603__100V_X7R_KEMET  [C_SMD_0603_(1608)_R_KEMET_REV01]  (not fitted in variant foxBMS_Debug)  (not fitted in variant foxBMS_DC-DC-only)
C519  10nF, 100V, 10%  10,0NF_0603__100V_X7R_KEMET  [C_SMD_0603_(1608)_R_KEMET_REV01]  (not fitted in variant foxBMS_Standard)  (not fitted in variant foxBMS_Debug)  (not fitted in variant foxBMS_DC-DC-only)
C520  10nF, 100V, 10%  10,0NF_0603__100V_X7R_KEMET  [C_SMD_0603_(1608)_R_KEMET_REV01]  (not fitted in variant foxBMS_Standard)  (not fitted in variant foxBMS_Debug)  (not fitted in variant foxBMS_DC-DC-only)
C521  10nF, 100V, 10%  10,0NF_0603__100V_X7R_KEMET  [C_SMD_0603_(1608)_R_KEMET_REV01]  (not fitted in variant foxBMS_Standard)  (not fitted in variant foxBMS_Debug)  (not fitted in variant foxBMS_DC-DC-only)
C522  10nF, 100V, 10%  10,0NF_0603__100V_X7R_KEMET  [C_SMD_0603_(1608)_R_KEMET_REV01]  (not fitted in variant foxBMS_Standard)  (not fitted in variant foxBMS_Debug)  (not fitted in variant foxBMS_DC-DC-only)
C523  10nF, 100V, 10%  10,0NF_0603__100V_X7R_KEMET  [C_SMD_0603_(1608)_R_KEMET_REV01]  (not fitted in variant foxBMS_Standard)  (not fitted in variant foxBMS_Debug)  (not fitted in variant foxBMS_DC-DC-only)
C524  10nF, 100V, 10%  10,0NF_0603__100V_X7R_KEMET  [C_SMD_0603_(1608)_R_KEMET_REV01]  (not fitted in variant foxBMS_Standard)  (not fitted in variant foxBMS_Debug)  (not fitted in variant foxBMS_DC-DC-only)
R501  100R_0603_R_VISHAY_1%_TK100_REV_01  [R_SMD_0603_R_VISHAY_REV01]  (not fitted in variant foxBMS_DC-DC-only)
R502  100R_0603_R_VISHAY_1%_TK100_REV_01  [R_SMD_0603_R_VISHAY_REV01]  (not fitted in variant foxBMS_DC-DC-only)
R503  100R_0603_R_VISHAY_1%_TK100_REV_01  [R_SMD_0603_R_VISHAY_REV01]  (not fitted in variant foxBMS_DC-DC-only)
R504  100R_0603_R_VISHAY_1%_TK100_REV_01  [R_SMD_0603_R_VISHAY_REV01]  (not fitted in variant foxBMS_DC-DC-only)
R505  100R_0603_R_VISHAY_1%_TK100_REV_01  [R_SMD_0603_R_VISHAY_REV01]  (not fitted in variant foxBMS_DC-DC-only)
R506  100R_0603_R_VISHAY_1%_TK100_REV_01  [R_SMD_0603_R_VISHAY_REV01]  (not fitted in variant foxBMS_DC-DC-only)
R507  100R_0603_R_VISHAY_1%_TK100_REV_01  [R_SMD_0603_R_VISHAY_REV01]  (not fitted in variant foxBMS_DC-DC-only)
R508  100R_0603_R_VISHAY_1%_TK100_REV_01  [R_SMD_0603_R_VISHAY_REV01]  (not fitted in variant foxBMS_DC-DC-only)
R509  100R_0603_R_VISHAY_1%_TK100_REV_01  [R_SMD_0603_R_VISHAY_REV01]  (not fitted in variant foxBMS_DC-DC-only)
R510  100R_0603_R_VISHAY_1%_TK100_REV_01  [R_SMD_0603_R_VISHAY_REV01]  (not fitted in variant foxBMS_DC-DC-only)
R511  100R_0603_R_VISHAY_1%_TK100_REV_01  [R_SMD_0603_R_VISHAY_REV01]  (not fitted in variant foxBMS_DC-DC-only)
R512  100R_0603_R_VISHAY_1%_TK100_REV_01  [R_SMD_0603_R_VISHAY_REV01]  (not fitted in variant foxBMS_DC-DC-only)
R513  100R_0603_R_VISHAY_1%_TK100_REV_01  [R_SMD_0603_R_VISHAY_REV01]  (not fitted in variant foxBMS_DC-DC-only)
Z501  6.8V, 500mW  MMSZ4692_T1G  [D_SMD_SOD-123_R_ON_REV01]  (not fitted in variant foxBMS_Debug)  (not fitted in variant foxBMS_DC-DC-only)
Z502  6.8V, 500mW  MMSZ4692_T1G  [D_SMD_SOD-123_R_ON_REV01]  (not fitted in variant foxBMS_Debug)  (not fitted in variant foxBMS_DC-DC-only)
Z503  6.8V, 500mW  MMSZ4692_T1G  [D_SMD_SOD-123_R_ON_REV01]  (not fitted in variant foxBMS_Debug)  (not fitted in variant foxBMS_DC-DC-only)
Z504  6.8V, 500mW  MMSZ4692_T1G  [D_SMD_SOD-123_R_ON_REV01]  (not fitted in variant foxBMS_Debug)  (not fitted in variant foxBMS_DC-DC-only)
Z505  6.8V, 500mW  MMSZ4692_T1G  [D_SMD_SOD-123_R_ON_REV01]  (not fitted in variant foxBMS_Debug)  (not fitted in variant foxBMS_DC-DC-only)
Z506  6.8V, 500mW  MMSZ4692_T1G  [D_SMD_SOD-123_R_ON_REV01]  (not fitted in variant foxBMS_Debug)  (not fitted in variant foxBMS_DC-DC-only)
Z507  6.8V, 500mW  MMSZ4692_T1G  [D_SMD_SOD-123_R_ON_REV01]  (not fitted in variant foxBMS_Debug)  (not fitted in variant foxBMS_DC-DC-only)
Z508  6.8V, 500mW  MMSZ4692_T1G  [D_SMD_SOD-123_R_ON_REV01]  (not fitted in variant foxBMS_Debug)  (not fitted in variant foxBMS_DC-DC-only)
Z509  6.8V, 500mW  MMSZ4692_T1G  [D_SMD_SOD-123_R_ON_REV01]  (not fitted in variant foxBMS_Debug)  (not fitted in variant foxBMS_DC-DC-only)
Z510  6.8V, 500mW  MMSZ4692_T1G  [D_SMD_SOD-123_R_ON_REV01]  (not fitted in variant foxBMS_Debug)  (not fitted in variant foxBMS_DC-DC-only)
Z511  6.8V, 500mW  MMSZ4692_T1G  [D_SMD_SOD-123_R_ON_REV01]  (not fitted in variant foxBMS_Debug)  (not fitted in variant foxBMS_DC-DC-only)
Z512  6.8V, 500mW  MMSZ4692_T1G  [D_SMD_SOD-123_R_ON_REV01]  (not fitted in variant foxBMS_Debug)  (not fitted in variant foxBMS_DC-DC-only)

### Nets
FUSED_CELL_0+: R506.1 ; also sheet 4,6,7,8
FUSED_CELL_0-: R507.1 ; also sheet 4,6,7,8
FUSED_CELL_1+: R505.1 ; also sheet 4,6,7,8
FUSED_CELL_2+: R504.1 ; also sheet 4,6,7,8
FUSED_CELL_3+: R503.1 ; also sheet 4,6,7,8
FUSED_CELL_4+: R502.1 ; also sheet 4,6,7,8
FUSED_CELL_5+: R501.1 ; also sheet 4,6,7,8
FUSED_CELL_6+: R513.1 ; also sheet 4,6,7,8
FUSED_CELL_7+: R512.1 ; also sheet 4,6,7,8
FUSED_CELL_8+: R511.1 ; also sheet 4,6,7,8
FUSED_CELL_9+: R510.1 ; also sheet 4,6,7,8
FUSED_CELL_10+: R509.1 ; also sheet 4,6,7,8
FUSED_CELL_11+: R508.1 ; also sheet 4,6,7
FUSED_VBAT-: C501.2 C502.2 C503.2 C504.2 C505.2 C506.2 C513.2 C514.2 C515.2 C516.2 C517.2 C518.2 ; also sheet 2,3,4,6,8,9,10,11,12,13,14,15,16
PRIMARY-C0: C512.2 R507.2 Z506.A ; also sheet 2
PRIMARY-C1: C506.1 C511.2 C512.1 R506.2 Z505.A Z506.K(C) ; also sheet 2
PRIMARY-C2: C505.1 C510.2 C511.1 R505.2 Z504.A Z505.K(C) ; also sheet 2
PRIMARY-C3: C504.1 C509.2 C510.1 R504.2 Z503.A Z504.K(C) ; also sheet 2
PRIMARY-C4: C503.1 C508.2 C509.1 R503.2 Z502.A Z503.K(C) ; also sheet 2
PRIMARY-C5: C502.1 C507.2 C508.1 R502.2 Z501.A Z502.K(C) ; also sheet 2
PRIMARY-C6: C501.1 C507.1 C524.2 R501.2 Z501.K(C) Z512.A ; also sheet 2
PRIMARY-C7: C518.1 C523.2 C524.1 R513.2 Z511.A Z512.K(C) ; also sheet 2
PRIMARY-C8: C517.1 C522.2 C523.1 R512.2 Z510.A Z511.K(C) ; also sheet 2
PRIMARY-C9: C516.1 C521.2 C522.1 R511.2 Z509.A Z510.K(C) ; also sheet 2
PRIMARY-C10: C515.1 C520.2 C521.1 R510.2 Z508.A Z509.K(C) ; also sheet 2
PRIMARY-C11: C514.1 C519.2 C520.1 R509.2 Z507.A Z508.K(C) ; also sheet 2
PRIMARY-C12: C513.1 C519.1 R508.2 Z507.K(C) ; also sheet 2

### Notes on the sheet
- optional: 
  differential 
  capacitor 
  filter
- optional: 
  differential 
  capacitor 
  filter
- Primary Voltage Measurement
- -3dB corner frequency of LTC6804 internal digital low-pass filter:
  fast mode: 27kHz
  normal mode: 6.8kHz
  filtered mode: 26Hz
  
  Grounded capacitor low-pass filter:
  C = 100nF -> fg = 16kHz
  C = 22nF -> fg = 72kHz
  C = 10nF -> fg = 160kHz (recommended)
  
  Differential capacitor low-pass filter (lower cost):
  C = 100nF -> fg = 11kHz
  C = 22nF -> fg = 50kHz
  C = 10nF -> fg = 112kHz

## Sheet 6 of 17: Secondary Voltage Measurement
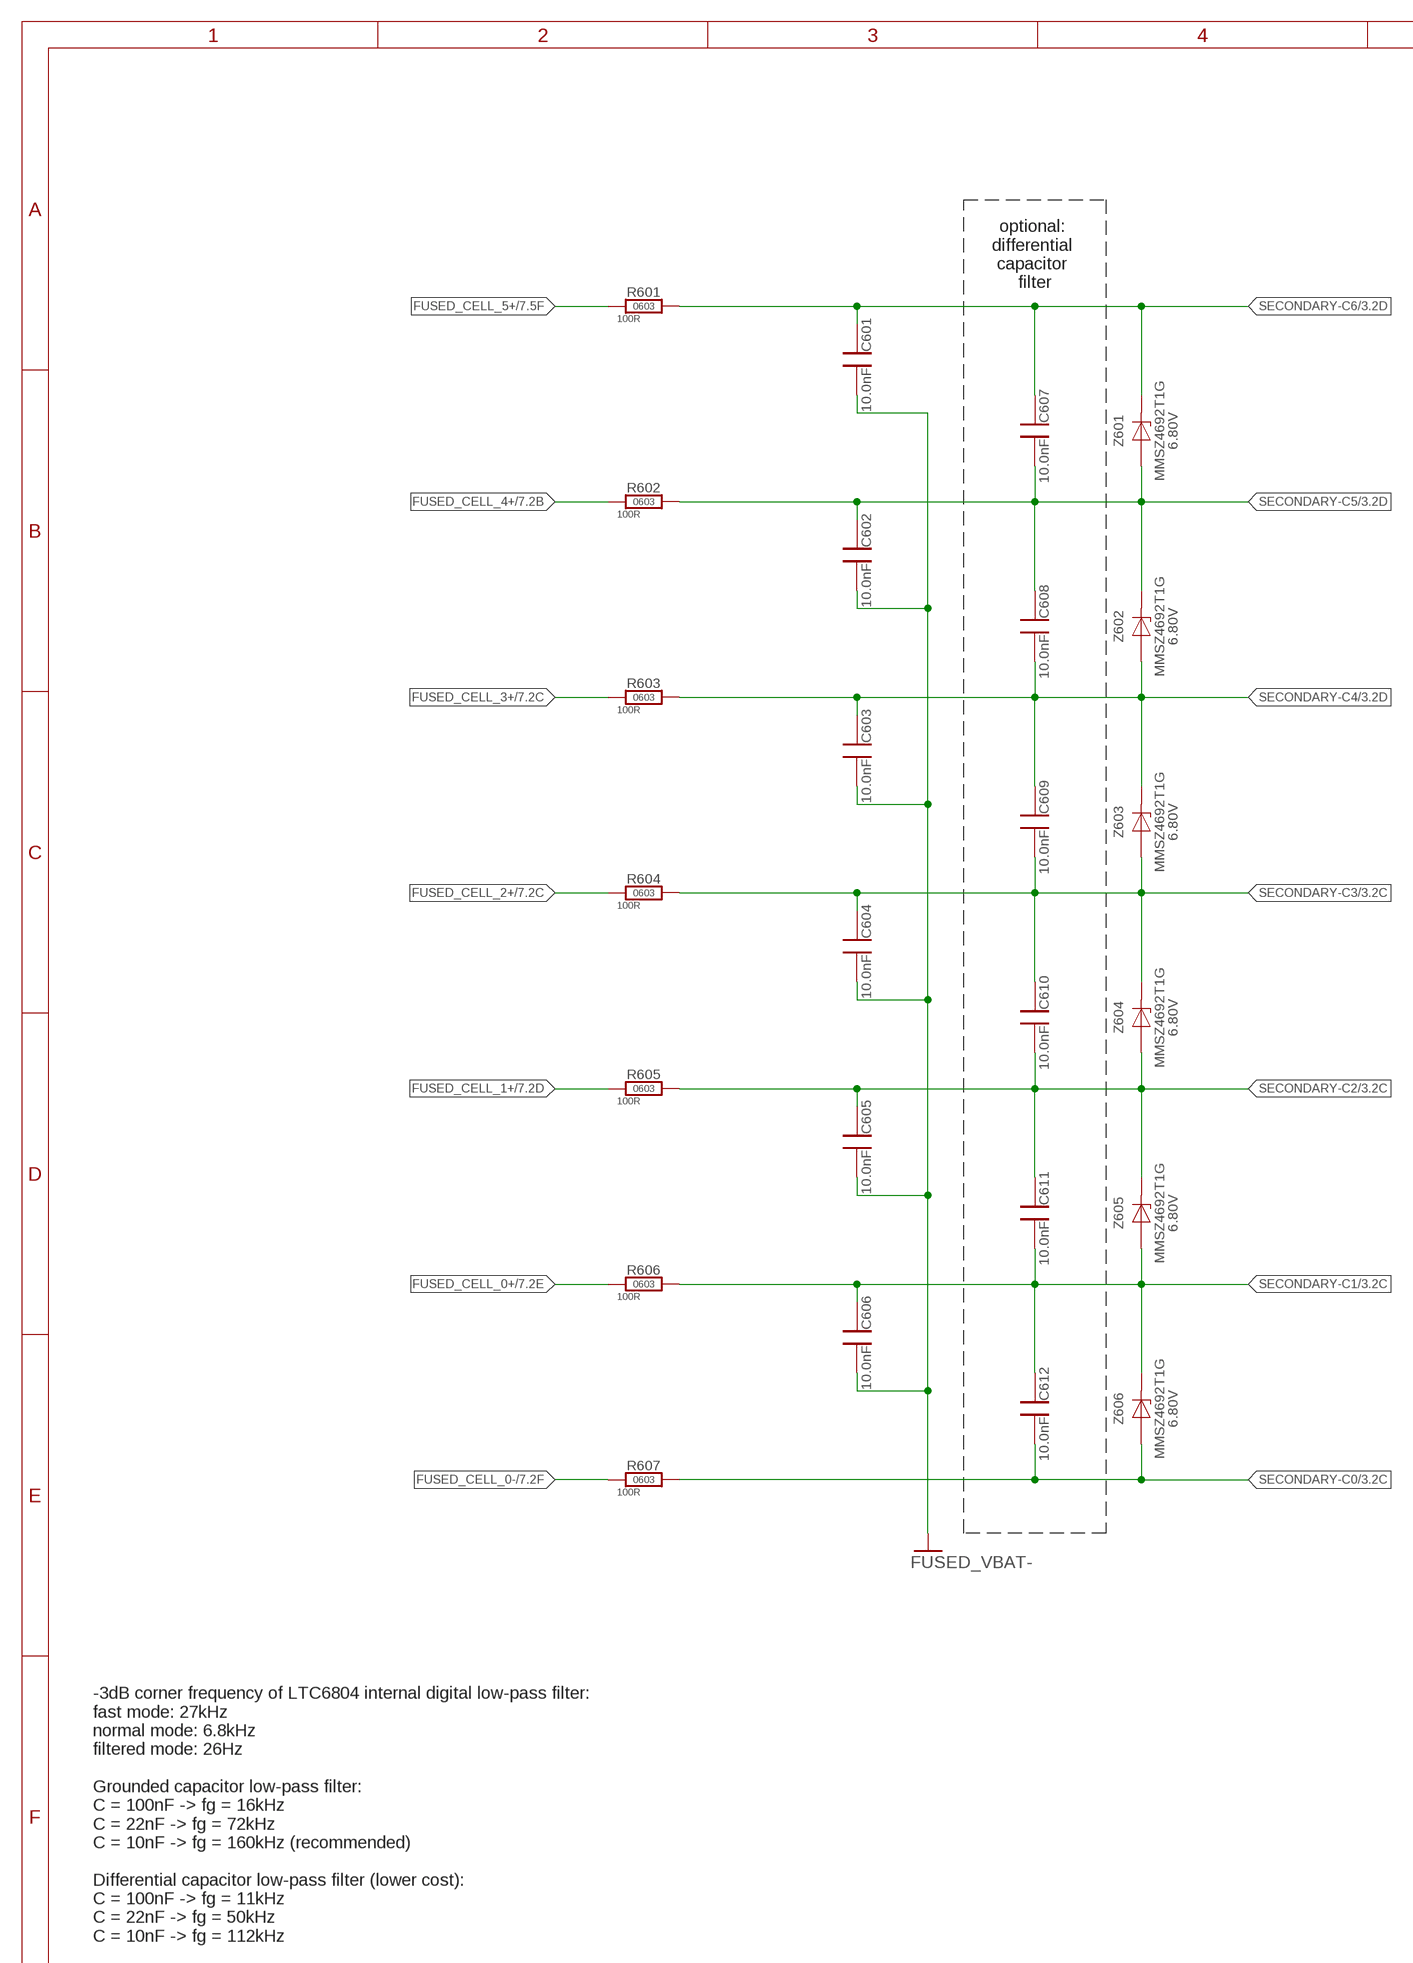
[diagram p9: schematic, sheet 6, part 1 of 2]
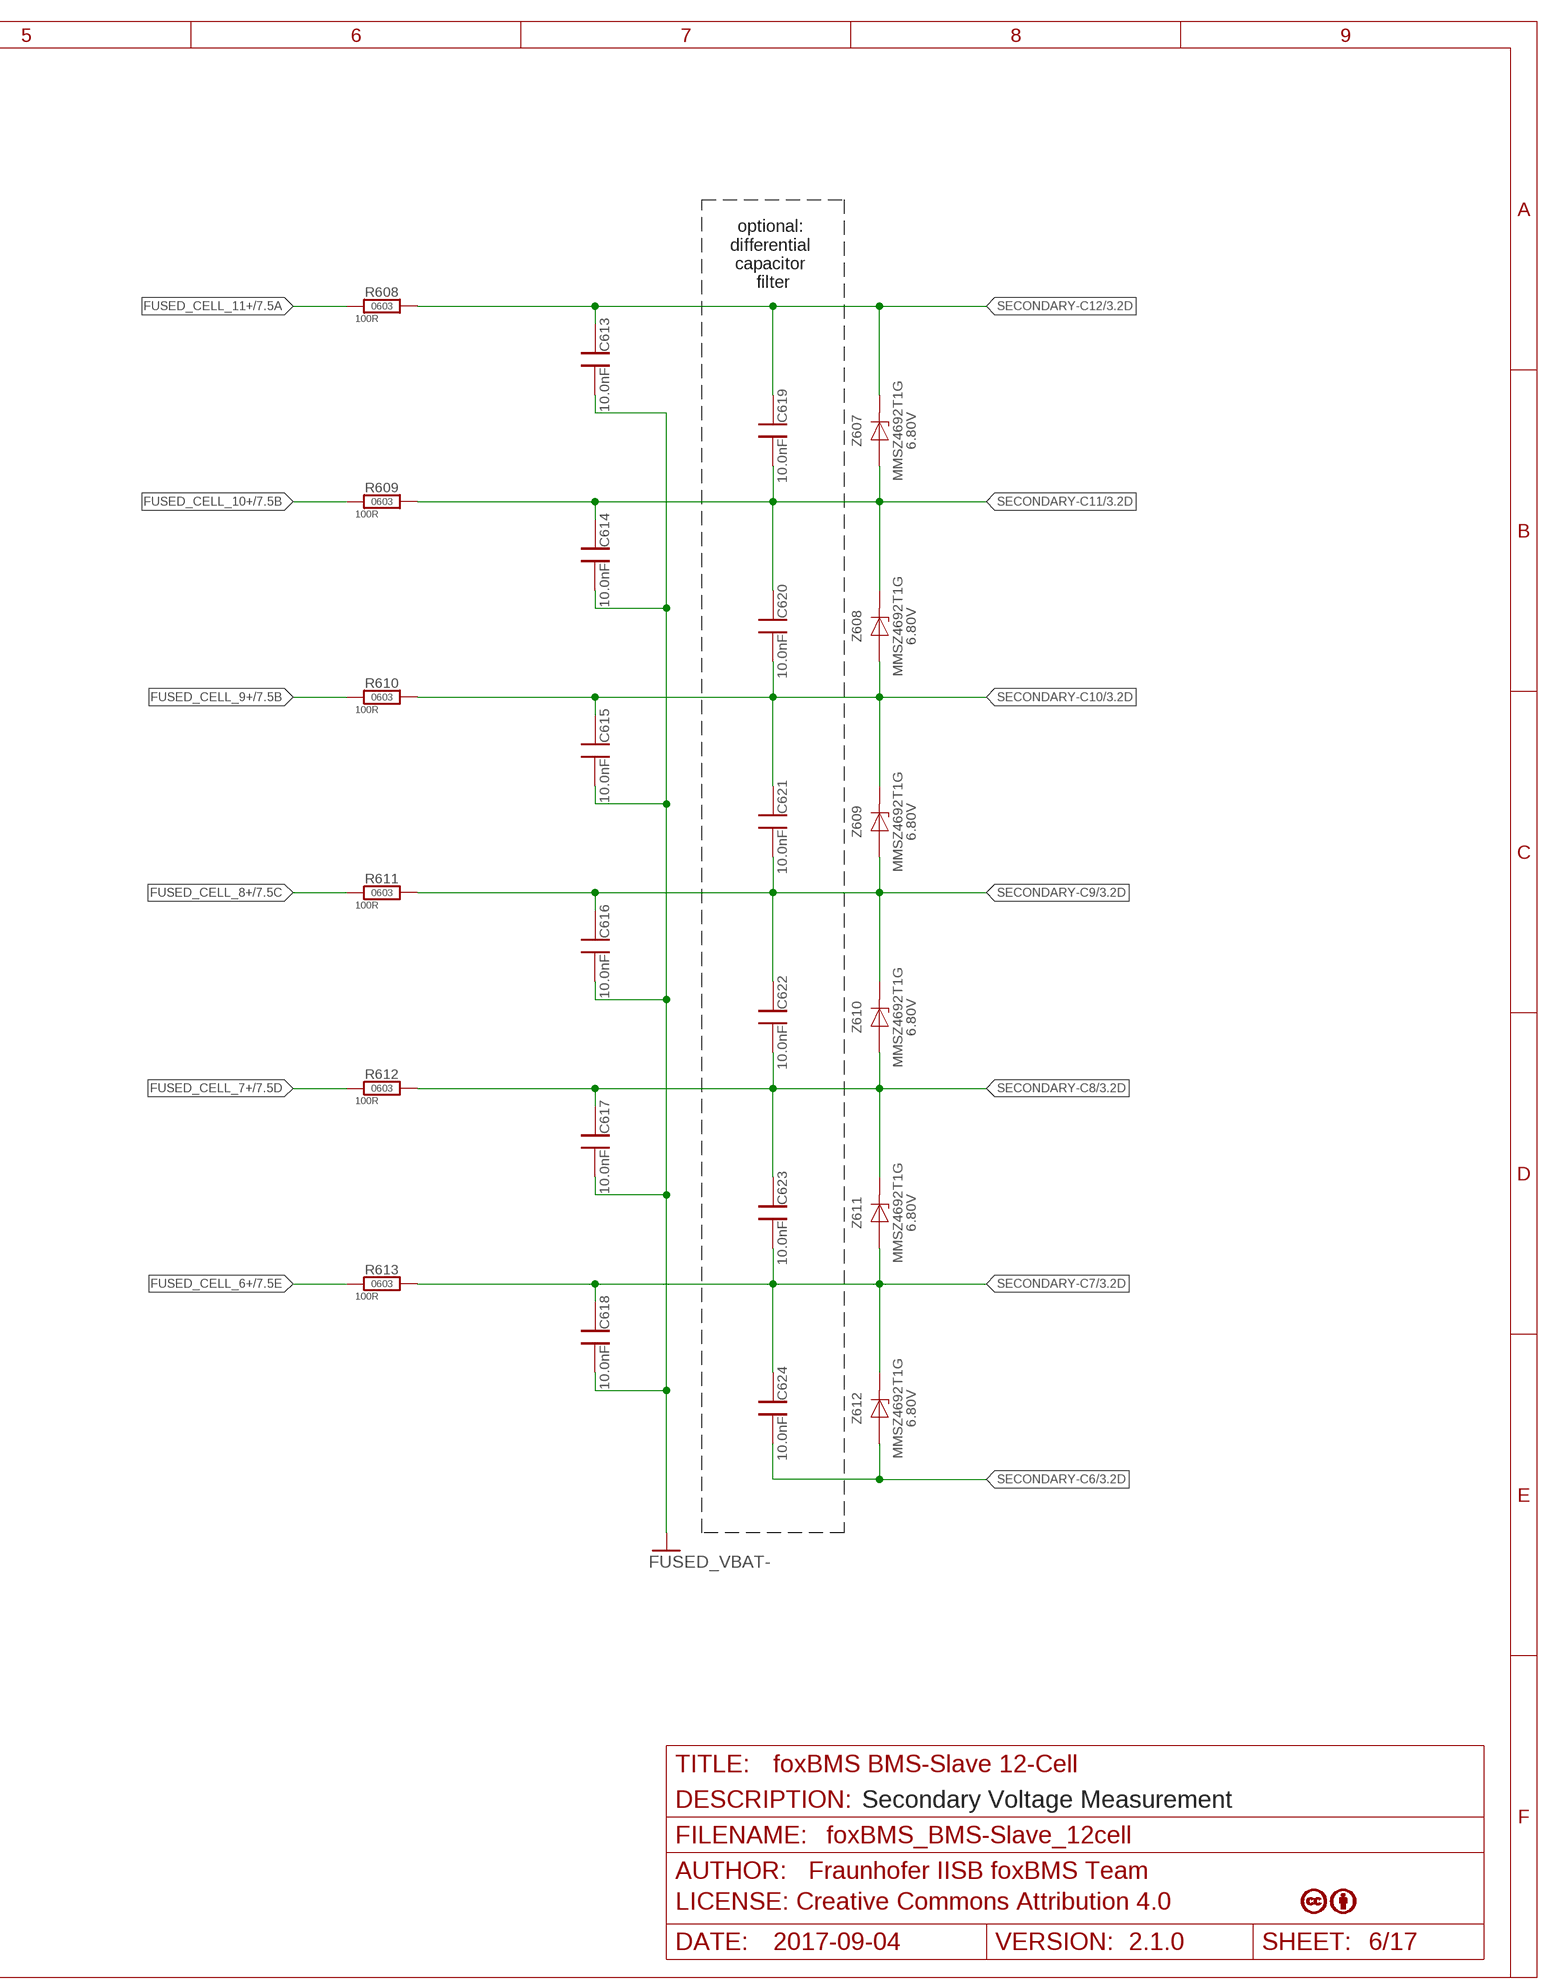
[diagram p10: schematic, sheet 6, part 2 of 2]

### Parts
C601  10nF, 100V, 10%  10,0NF_0603__100V_X7R_KEMET  [C_SMD_0603_(1608)_R_KEMET_REV01]  (not fitted in variant foxBMS_Debug)  (not fitted in variant foxBMS_DC-DC-only)
C602  10nF, 100V, 10%  10,0NF_0603__100V_X7R_KEMET  [C_SMD_0603_(1608)_R_KEMET_REV01]  (not fitted in variant foxBMS_Debug)  (not fitted in variant foxBMS_DC-DC-only)
C603  10nF, 100V, 10%  10,0NF_0603__100V_X7R_KEMET  [C_SMD_0603_(1608)_R_KEMET_REV01]  (not fitted in variant foxBMS_Debug)  (not fitted in variant foxBMS_DC-DC-only)
C604  10nF, 100V, 10%  10,0NF_0603__100V_X7R_KEMET  [C_SMD_0603_(1608)_R_KEMET_REV01]  (not fitted in variant foxBMS_Debug)  (not fitted in variant foxBMS_DC-DC-only)
C605  10nF, 100V, 10%  10,0NF_0603__100V_X7R_KEMET  [C_SMD_0603_(1608)_R_KEMET_REV01]  (not fitted in variant foxBMS_Debug)  (not fitted in variant foxBMS_DC-DC-only)
C606  10nF, 100V, 10%  10,0NF_0603__100V_X7R_KEMET  [C_SMD_0603_(1608)_R_KEMET_REV01]  (not fitted in variant foxBMS_Debug)  (not fitted in variant foxBMS_DC-DC-only)
C607  10nF, 100V, 10%  10,0NF_0603__100V_X7R_KEMET  [C_SMD_0603_(1608)_R_KEMET_REV01]  (not fitted in variant foxBMS_Standard)  (not fitted in variant foxBMS_Debug)  (not fitted in variant foxBMS_DC-DC-only)
C608  10nF, 100V, 10%  10,0NF_0603__100V_X7R_KEMET  [C_SMD_0603_(1608)_R_KEMET_REV01]  (not fitted in variant foxBMS_Standard)  (not fitted in variant foxBMS_Debug)  (not fitted in variant foxBMS_DC-DC-only)
C609  10nF, 100V, 10%  10,0NF_0603__100V_X7R_KEMET  [C_SMD_0603_(1608)_R_KEMET_REV01]  (not fitted in variant foxBMS_Standard)  (not fitted in variant foxBMS_Debug)  (not fitted in variant foxBMS_DC-DC-only)
C610  10nF, 100V, 10%  10,0NF_0603__100V_X7R_KEMET  [C_SMD_0603_(1608)_R_KEMET_REV01]  (not fitted in variant foxBMS_Standard)  (not fitted in variant foxBMS_Debug)  (not fitted in variant foxBMS_DC-DC-only)
C611  10nF, 100V, 10%  10,0NF_0603__100V_X7R_KEMET  [C_SMD_0603_(1608)_R_KEMET_REV01]  (not fitted in variant foxBMS_Standard)  (not fitted in variant foxBMS_Debug)  (not fitted in variant foxBMS_DC-DC-only)
C612  10nF, 100V, 10%  10,0NF_0603__100V_X7R_KEMET  [C_SMD_0603_(1608)_R_KEMET_REV01]  (not fitted in variant foxBMS_Standard)  (not fitted in variant foxBMS_Debug)  (not fitted in variant foxBMS_DC-DC-only)
C613  10nF, 100V, 10%  10,0NF_0603__100V_X7R_KEMET  [C_SMD_0603_(1608)_R_KEMET_REV01]  (not fitted in variant foxBMS_Debug)  (not fitted in variant foxBMS_DC-DC-only)
C614  10nF, 100V, 10%  10,0NF_0603__100V_X7R_KEMET  [C_SMD_0603_(1608)_R_KEMET_REV01]  (not fitted in variant foxBMS_Debug)  (not fitted in variant foxBMS_DC-DC-only)
C615  10nF, 100V, 10%  10,0NF_0603__100V_X7R_KEMET  [C_SMD_0603_(1608)_R_KEMET_REV01]  (not fitted in variant foxBMS_Debug)  (not fitted in variant foxBMS_DC-DC-only)
C616  10nF, 100V, 10%  10,0NF_0603__100V_X7R_KEMET  [C_SMD_0603_(1608)_R_KEMET_REV01]  (not fitted in variant foxBMS_Debug)  (not fitted in variant foxBMS_DC-DC-only)
C617  10nF, 100V, 10%  10,0NF_0603__100V_X7R_KEMET  [C_SMD_0603_(1608)_R_KEMET_REV01]  (not fitted in variant foxBMS_Debug)  (not fitted in variant foxBMS_DC-DC-only)
C618  10nF, 100V, 10%  10,0NF_0603__100V_X7R_KEMET  [C_SMD_0603_(1608)_R_KEMET_REV01]  (not fitted in variant foxBMS_Debug)  (not fitted in variant foxBMS_DC-DC-only)
C619  10nF, 100V, 10%  10,0NF_0603__100V_X7R_KEMET  [C_SMD_0603_(1608)_R_KEMET_REV01]  (not fitted in variant foxBMS_Standard)  (not fitted in variant foxBMS_Debug)  (not fitted in variant foxBMS_DC-DC-only)
C620  10nF, 100V, 10%  10,0NF_0603__100V_X7R_KEMET  [C_SMD_0603_(1608)_R_KEMET_REV01]  (not fitted in variant foxBMS_Standard)  (not fitted in variant foxBMS_Debug)  (not fitted in variant foxBMS_DC-DC-only)
C621  10nF, 100V, 10%  10,0NF_0603__100V_X7R_KEMET  [C_SMD_0603_(1608)_R_KEMET_REV01]  (not fitted in variant foxBMS_Standard)  (not fitted in variant foxBMS_Debug)  (not fitted in variant foxBMS_DC-DC-only)
C622  10nF, 100V, 10%  10,0NF_0603__100V_X7R_KEMET  [C_SMD_0603_(1608)_R_KEMET_REV01]  (not fitted in variant foxBMS_Standard)  (not fitted in variant foxBMS_Debug)  (not fitted in variant foxBMS_DC-DC-only)
C623  10nF, 100V, 10%  10,0NF_0603__100V_X7R_KEMET  [C_SMD_0603_(1608)_R_KEMET_REV01]  (not fitted in variant foxBMS_Standard)  (not fitted in variant foxBMS_Debug)  (not fitted in variant foxBMS_DC-DC-only)
C624  10nF, 100V, 10%  10,0NF_0603__100V_X7R_KEMET  [C_SMD_0603_(1608)_R_KEMET_REV01]  (not fitted in variant foxBMS_Standard)  (not fitted in variant foxBMS_Debug)  (not fitted in variant foxBMS_DC-DC-only)
R601  100R_0603_R_VISHAY_1%_TK100_REV_01  [R_SMD_0603_R_VISHAY_REV01]  (not fitted in variant foxBMS_DC-DC-only)
R602  100R_0603_R_VISHAY_1%_TK100_REV_01  [R_SMD_0603_R_VISHAY_REV01]  (not fitted in variant foxBMS_DC-DC-only)
R603  100R_0603_R_VISHAY_1%_TK100_REV_01  [R_SMD_0603_R_VISHAY_REV01]  (not fitted in variant foxBMS_DC-DC-only)
R604  100R_0603_R_VISHAY_1%_TK100_REV_01  [R_SMD_0603_R_VISHAY_REV01]  (not fitted in variant foxBMS_DC-DC-only)
R605  100R_0603_R_VISHAY_1%_TK100_REV_01  [R_SMD_0603_R_VISHAY_REV01]  (not fitted in variant foxBMS_DC-DC-only)
R606  100R_0603_R_VISHAY_1%_TK100_REV_01  [R_SMD_0603_R_VISHAY_REV01]  (not fitted in variant foxBMS_DC-DC-only)
R607  100R_0603_R_VISHAY_1%_TK100_REV_01  [R_SMD_0603_R_VISHAY_REV01]  (not fitted in variant foxBMS_DC-DC-only)
R608  100R_0603_R_VISHAY_1%_TK100_REV_01  [R_SMD_0603_R_VISHAY_REV01]  (not fitted in variant foxBMS_DC-DC-only)
R609  100R_0603_R_VISHAY_1%_TK100_REV_01  [R_SMD_0603_R_VISHAY_REV01]  (not fitted in variant foxBMS_DC-DC-only)
R610  100R_0603_R_VISHAY_1%_TK100_REV_01  [R_SMD_0603_R_VISHAY_REV01]  (not fitted in variant foxBMS_DC-DC-only)
R611  100R_0603_R_VISHAY_1%_TK100_REV_01  [R_SMD_0603_R_VISHAY_REV01]  (not fitted in variant foxBMS_DC-DC-only)
R612  100R_0603_R_VISHAY_1%_TK100_REV_01  [R_SMD_0603_R_VISHAY_REV01]  (not fitted in variant foxBMS_DC-DC-only)
R613  100R_0603_R_VISHAY_1%_TK100_REV_01  [R_SMD_0603_R_VISHAY_REV01]  (not fitted in variant foxBMS_DC-DC-only)
Z601  6.8V, 500mW  MMSZ4692_T1G  [D_SMD_SOD-123_R_ON_REV01]  (not fitted in variant foxBMS_Debug)  (not fitted in variant foxBMS_DC-DC-only)
Z602  6.8V, 500mW  MMSZ4692_T1G  [D_SMD_SOD-123_R_ON_REV01]  (not fitted in variant foxBMS_Debug)  (not fitted in variant foxBMS_DC-DC-only)
Z603  6.8V, 500mW  MMSZ4692_T1G  [D_SMD_SOD-123_R_ON_REV01]  (not fitted in variant foxBMS_Debug)  (not fitted in variant foxBMS_DC-DC-only)
Z604  6.8V, 500mW  MMSZ4692_T1G  [D_SMD_SOD-123_R_ON_REV01]  (not fitted in variant foxBMS_Debug)  (not fitted in variant foxBMS_DC-DC-only)
Z605  6.8V, 500mW  MMSZ4692_T1G  [D_SMD_SOD-123_R_ON_REV01]  (not fitted in variant foxBMS_Debug)  (not fitted in variant foxBMS_DC-DC-only)
Z606  6.8V, 500mW  MMSZ4692_T1G  [D_SMD_SOD-123_R_ON_REV01]  (not fitted in variant foxBMS_Debug)  (not fitted in variant foxBMS_DC-DC-only)
Z607  6.8V, 500mW  MMSZ4692_T1G  [D_SMD_SOD-123_R_ON_REV01]  (not fitted in variant foxBMS_Debug)  (not fitted in variant foxBMS_DC-DC-only)
Z608  6.8V, 500mW  MMSZ4692_T1G  [D_SMD_SOD-123_R_ON_REV01]  (not fitted in variant foxBMS_Debug)  (not fitted in variant foxBMS_DC-DC-only)
Z609  6.8V, 500mW  MMSZ4692_T1G  [D_SMD_SOD-123_R_ON_REV01]  (not fitted in variant foxBMS_Debug)  (not fitted in variant foxBMS_DC-DC-only)
Z610  6.8V, 500mW  MMSZ4692_T1G  [D_SMD_SOD-123_R_ON_REV01]  (not fitted in variant foxBMS_Debug)  (not fitted in variant foxBMS_DC-DC-only)
Z611  6.8V, 500mW  MMSZ4692_T1G  [D_SMD_SOD-123_R_ON_REV01]  (not fitted in variant foxBMS_Debug)  (not fitted in variant foxBMS_DC-DC-only)
Z612  6.8V, 500mW  MMSZ4692_T1G  [D_SMD_SOD-123_R_ON_REV01]  (not fitted in variant foxBMS_Debug)  (not fitted in variant foxBMS_DC-DC-only)

### Nets
FUSED_CELL_0+: R606.1 ; also sheet 4,5,7,8
FUSED_CELL_0-: R607.1 ; also sheet 4,5,7,8
FUSED_CELL_1+: R605.1 ; also sheet 4,5,7,8
FUSED_CELL_2+: R604.1 ; also sheet 4,5,7,8
FUSED_CELL_3+: R603.1 ; also sheet 4,5,7,8
FUSED_CELL_4+: R602.1 ; also sheet 4,5,7,8
FUSED_CELL_5+: R601.1 ; also sheet 4,5,7,8
FUSED_CELL_6+: R613.1 ; also sheet 4,5,7,8
FUSED_CELL_7+: R612.1 ; also sheet 4,5,7,8
FUSED_CELL_8+: R611.1 ; also sheet 4,5,7,8
FUSED_CELL_9+: R610.1 ; also sheet 4,5,7,8
FUSED_CELL_10+: R609.1 ; also sheet 4,5,7,8
FUSED_CELL_11+: R608.1 ; also sheet 4,5,7
FUSED_VBAT-: C601.2 C602.2 C603.2 C604.2 C605.2 C606.2 C613.2 C614.2 C615.2 C616.2 C617.2 C618.2 ; also sheet 2,3,4,5,8,9,10,11,12,13,14,15,16
SECONDARY-C0: C612.2 R607.2 Z606.A ; also sheet 3
SECONDARY-C1: C606.1 C611.2 C612.1 R606.2 Z605.A Z606.K(C) ; also sheet 3
SECONDARY-C2: C605.1 C610.2 C611.1 R605.2 Z604.A Z605.K(C) ; also sheet 3
SECONDARY-C3: C604.1 C609.2 C610.1 R604.2 Z603.A Z604.K(C) ; also sheet 3
SECONDARY-C4: C603.1 C608.2 C609.1 R603.2 Z602.A Z603.K(C) ; also sheet 3
SECONDARY-C5: C602.1 C607.2 C608.1 R602.2 Z601.A Z602.K(C) ; also sheet 3
SECONDARY-C6: C601.1 C607.1 C624.2 R601.2 Z601.K(C) Z612.A ; also sheet 3
SECONDARY-C7: C618.1 C623.2 C624.1 R613.2 Z611.A Z612.K(C) ; also sheet 3
SECONDARY-C8: C617.1 C622.2 C623.1 R612.2 Z610.A Z611.K(C) ; also sheet 3
SECONDARY-C9: C616.1 C621.2 C622.1 R611.2 Z609.A Z610.K(C) ; also sheet 3
SECONDARY-C10: C615.1 C620.2 C621.1 R610.2 Z608.A Z609.K(C) ; also sheet 3
SECONDARY-C11: C614.1 C619.2 C620.1 R609.2 Z607.A Z608.K(C) ; also sheet 3
SECONDARY-C12: C613.1 C619.1 R608.2 Z607.K(C) ; also sheet 3

### Notes on the sheet
- optional: 
  differential 
  capacitor 
  filter
- optional: 
  differential 
  capacitor 
  filter
- Secondary Voltage Measurement
- -3dB corner frequency of LTC6804 internal digital low-pass filter:
  fast mode: 27kHz
  normal mode: 6.8kHz
  filtered mode: 26Hz
  
  Grounded capacitor low-pass filter:
  C = 100nF -> fg = 16kHz
  C = 22nF -> fg = 72kHz
  C = 10nF -> fg = 160kHz (recommended)
  
  Differential capacitor low-pass filter (lower cost):
  C = 100nF -> fg = 11kHz
  C = 22nF -> fg = 50kHz
  C = 10nF -> fg = 112kHz